# Altium project k7masterProject.PrjPcb
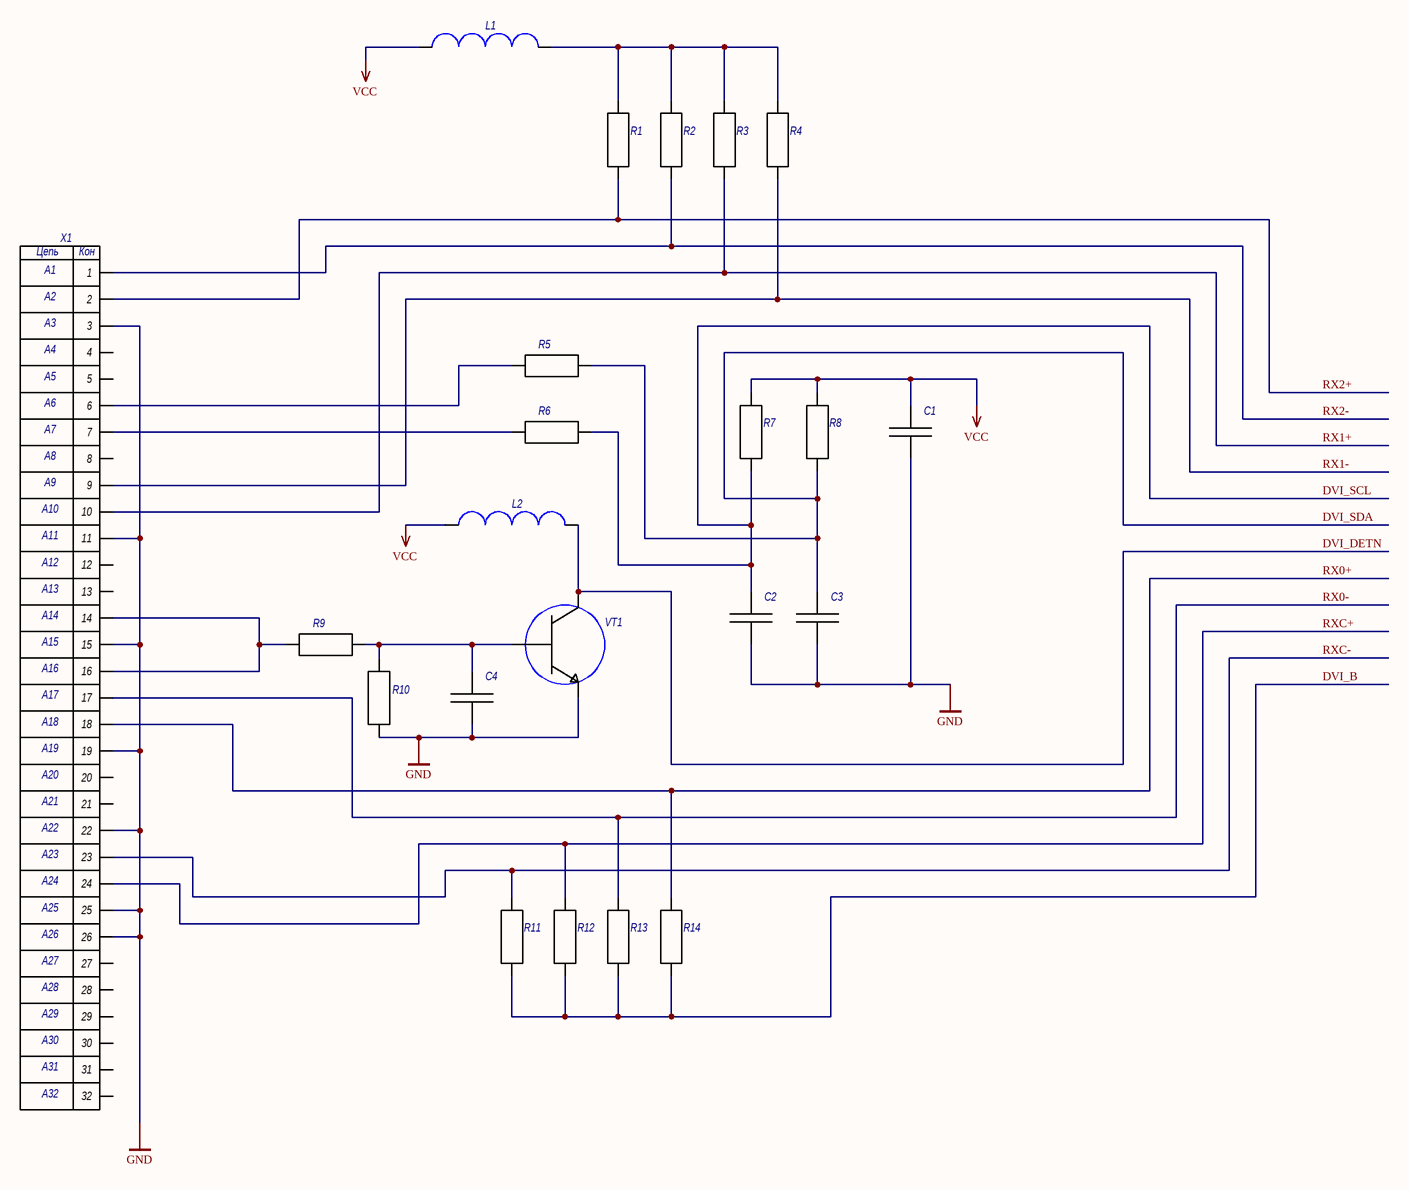
[diagram p0: sch1.SchDoc]
6 sheets, 398 parts. Net scope: global (net labels, ports and power ports of the same name join across sheets).
Board file: PCB2.PcbDoc
Sheets:
  sch1.SchDoc
  sch2.SchDoc
  sch3.SchDoc
  sch4.SchDoc
  sch5_1.SchDoc
  sch6.SchDoc

## Sheet sch1.SchDoc
size 420 x 297 mm; Address1: Address1; Address2: Address2; Address3: Address3; Address4: Address4; DocumentNumber: АБВГ.123456.001 Э3; SheetNumber: 1; Scale: 1:1; DocumentType: Схема электрическая принципиальная; FirstReferrence: АБВГ.123456.001

### Parts
C1  *  [Capacitor 0805]  (value not drawn)
C2  *  [Capacitor 0805]  (value not drawn)
C3  *  [Capacitor 0805]  (value not drawn)
C4  *  [Capacitor 0805]  (value not drawn)
L1  *  [Inductor 2520]  (value not drawn)
L2  *  [Inductor 2520]  (value not drawn)
R1  *  [Resistor 1206]  (value not drawn)
R2  *  [Resistor 1206]  (value not drawn)
R3  *  [Resistor 1206]  (value not drawn)
R4  *  [Resistor 1206]  (value not drawn)
R5  *  [Resistor 1206]  (value not drawn)
R6  *  [Resistor 1206]  (value not drawn)
R7  *  [Resistor 1206]  (value not drawn)
R8  *  [Resistor 1206]  (value not drawn)
R9  *  [Resistor 1206]  (value not drawn)
R10  *  [Resistor 1206]  (value not drawn)
R11  *  [Resistor 1206]  (value not drawn)
R12  *  [Resistor 1206]  (value not drawn)
R13  *  [Resistor 1206]  (value not drawn)
R14  *  [Resistor 1206]  (value not drawn)
VT1  *  [Transistor 1]  (value not drawn)
X1  *  [DVI Connector]  (value not drawn)

### Nets
GND: C1.1 C2.1 C3.1 C4.1 R10.1 VT1.1(KOLLECTOR) X1.3 X1.11 X1.15 X1.19 X1.22 X1.25 X1.26
VCC: C1.2 L1.1 L2.1 R7.2 R8.2
DVI_B: R11.1 R12.1 R13.1 R14.1
DVI_DETN: L2.2 VT1.2(EMITTER)
DVI_SCL: C2.2 R6.2 R7.1
DVI_SDA: C3.2 R5.2 R8.1
RX0+: R14.2 X1.18
RX0-: R13.2 X1.17
RX1+: R3.1 X1.10
RX1-: R4.1 X1.9
RX2+: R1.1 X1.2
RX2-: R2.1 X1.1
RXC+: R12.2 X1.24
RXC-: R11.2 X1.23
NetC4_2: C4.2 R9.2 R10.2 VT1.3(BAZA)
NetL1_2: L1.2 R1.2 R2.2 R3.2 R4.2
NetR5_1: R5.1 X1.6
NetR6_1: R6.1 X1.7
NetR9_1: R9.1 X1.14 X1.16

Not connected (* = marked no-connect by the designer): X1 4 5 8 12 13 20 21 27 28 29 30 31 32

### Notes on the sheet
- Перв. примен.
- Справ. №
- Подп. и дата
- Инв. № дубл.
- Взам. инв. №
- Разраб.
- Изм.
- Лист
- № докум.
- Подп.
- Дата
- Лит.
- Масса
- Масштаб
- Пров.
- Т.контр.
- Листов
- Инв. № подл.
- Утв.
- Н.контр.
- 2.106-A3
- Копировал
- Формат А3
- (in symbol DVI Connector) Цепь; Кон; A1; A2; A3; A4; A5; A6; A7; A8; A9; A10; A11; A12; A13; A14; A15; A16; A17; A18; A19; A20; A21; A22; A23; A24; A25; A26; A27; A28; A29; A30; A31; A32

### Library data of the parts
C1-C4 = Capacitor: Model: *
L1 L2 = Inductor: Model: *
R1-R14 = Resistor: Model: *
VT1 = Transistor 1
X1 = DVI Connector

## Sheet sch2.SchDoc
size 420 x 297 mm; Address1: Address1; Address2: Address2; Address3: Address3; Address4: Address4; DocumentNumber: АБВГ.123456.001 Э3; SheetNumber: 1; Scale: 1:1; DocumentType: Схема электрическая принципиальная; FirstReferrence: АБВГ.123456.001
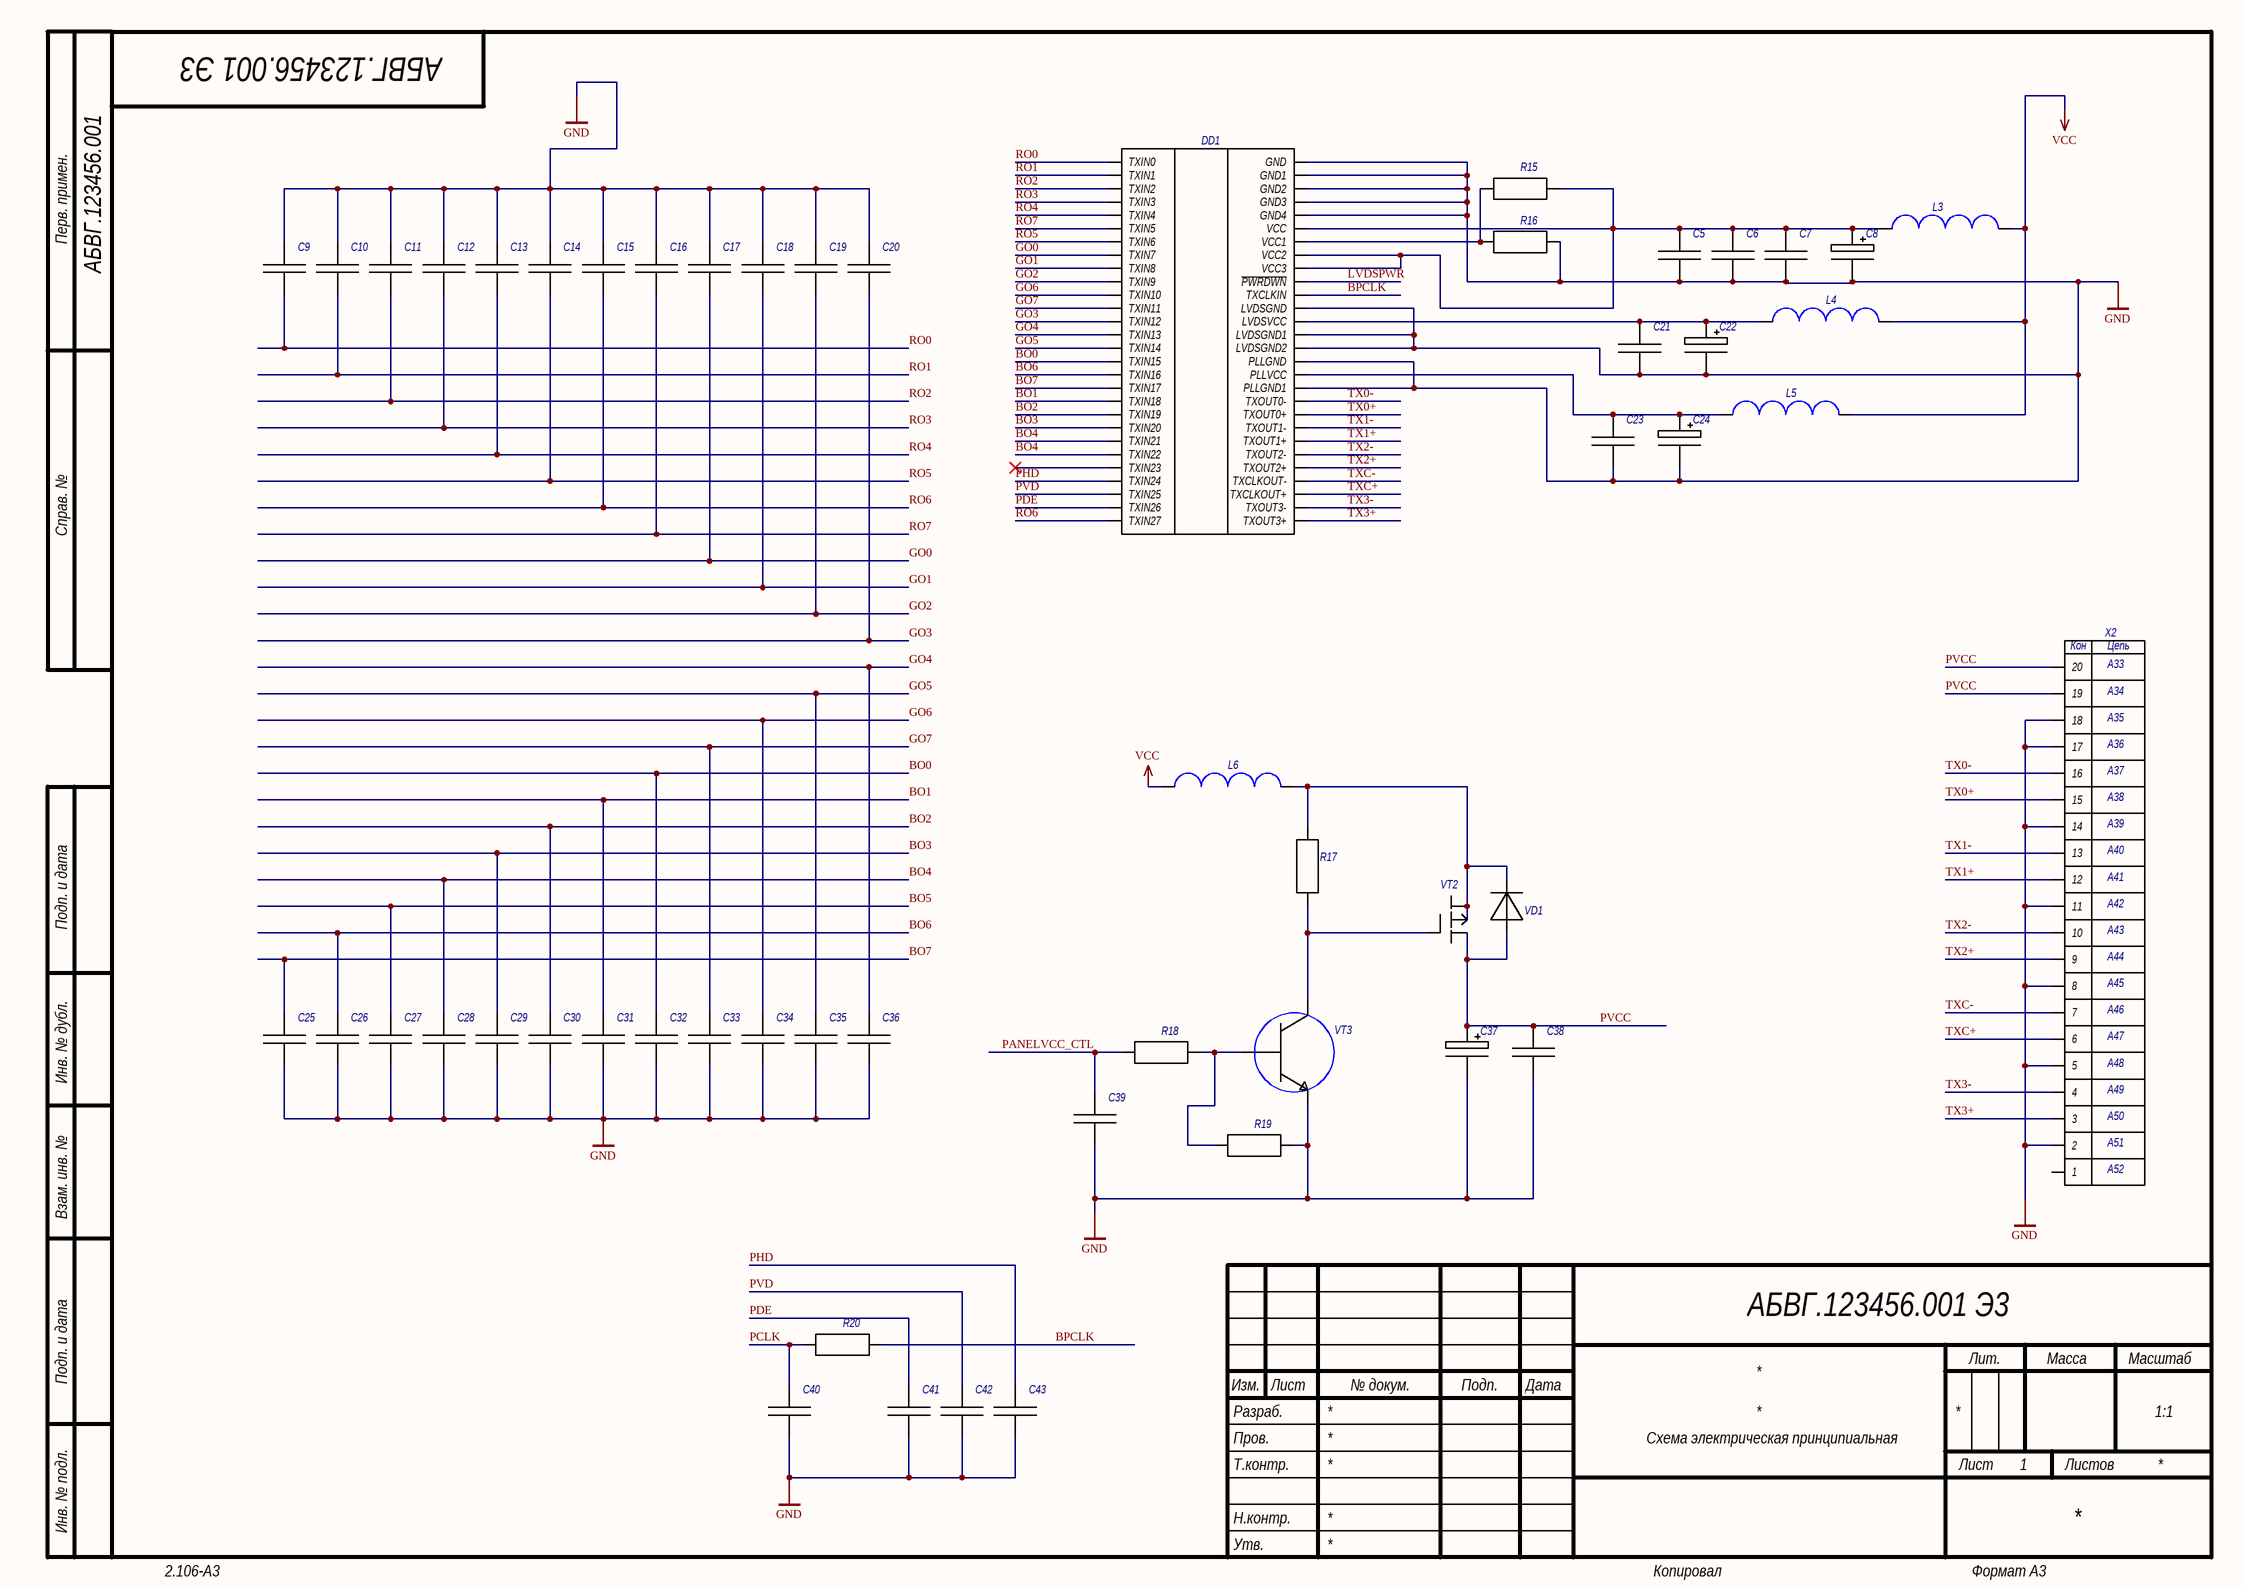
[diagram p1: sch2.SchDoc]

### Parts
C5  *  [Capacitor 0805]  (value not drawn)
C6  *  [Capacitor 0805]  (value not drawn)
C7  *  [Capacitor 0805]  (value not drawn)
C8  *  [Capacitor 0805]  (value not drawn)
C9  *  [Capacitor 0805]  (value not drawn)
C10  *  [Capacitor 0805]  (value not drawn)
C11  *  [Capacitor 0805]  (value not drawn)
C12  *  [Capacitor 0805]  (value not drawn)
C13  *  [Capacitor 0805]  (value not drawn)
C14  *  [Capacitor 0805]  (value not drawn)
C15  *  [Capacitor 0805]  (value not drawn)
C16  *  [Capacitor 0805]  (value not drawn)
C17  *  [Capacitor 0805]  (value not drawn)
C18  *  [Capacitor 0805]  (value not drawn)
C19  *  [Capacitor 0805]  (value not drawn)
C20  *  [Capacitor 0805]  (value not drawn)
C21  *  [Capacitor 0805]  (value not drawn)
C22  *  [Capacitor 0805]  (value not drawn)
C23  *  [Capacitor 0805]  (value not drawn)
C24  *  [Capacitor 0805]  (value not drawn)
C25  *  [Capacitor 0805]  (value not drawn)
C26  *  [Capacitor 0805]  (value not drawn)
C27  *  [Capacitor 0805]  (value not drawn)
C28  *  [Capacitor 0805]  (value not drawn)
C29  *  [Capacitor 0805]  (value not drawn)
C30  *  [Capacitor 0805]  (value not drawn)
C31  *  [Capacitor 0805]  (value not drawn)
C32  *  [Capacitor 0805]  (value not drawn)
C33  *  [Capacitor 0805]  (value not drawn)
C34  *  [Capacitor 0805]  (value not drawn)
C35  *  [Capacitor 0805]  (value not drawn)
C36  *  [Capacitor 0805]  (value not drawn)
C37  *  [Capacitor 0805]  (value not drawn)
C38  *  [Capacitor 0805]  (value not drawn)
C39  *  [Capacitor 0805]  (value not drawn)
C40  *  [Capacitor 0805]  (value not drawn)
C41  *  [Capacitor 0805]  (value not drawn)
C42  *  [Capacitor 0805]  (value not drawn)
C43  *  [Capacitor 0805]  (value not drawn)
DD1  *  [THC63_1]  (value not drawn)
L3  *  [Inductor 2520]  (value not drawn)
L4  *  [Inductor 2520]  (value not drawn)
L5  *  [Inductor 2520]  (value not drawn)
L6  *  [Inductor 2520]  (value not drawn)
R15  *  [Resistor 1206]  (value not drawn)
R16  *  [Resistor 1206]  (value not drawn)
R17  *  [Resistor 1206]  (value not drawn)
R18  *  [Resistor 1206]  (value not drawn)
R19  *  [Resistor 1206]  (value not drawn)
R20  *  [Resistor 1206]  (value not drawn)
VD1  Diode 1  [Diode]  (value not drawn)
VT2  MOP TRANSISTOR  [TR]  (value not drawn)
VT3  *  [Transistor 1]  (value not drawn)
X2  *  [DF14A]  (value not drawn)

### Nets
GND: C5.1 C6.1 C7.1 C8.1 C9.2 C10.2 C11.2 C12.2 C13.2 C14.2 C15.2 C16.2 C17.2 C18.2 C19.2 C20.2 C21.1 C22.1 C23.1 C24.1 C25.1 C26.1 C27.1 C28.1 C29.1 C30.1 C31.1 C32.1 C33.1 C34.1 C35.1 C36.1 C37.1 C38.1 C39.1 C40.1 C41.1 C42.1 C43.1 DD1.39(PLLGND1) DD1.41(PLLGND) DD1.42(LVDSGND2) DD1.43(LVDSGND1) DD1.45(LVDSGND) DD1.52(GND4) DD1.53(GND3) DD1.54(GND2) DD1.55(GND1) DD1.56(GND) R16.2 R19.2 VT3.1(KOLLECTOR) X2.2 X2.5 X2.8 X2.11 X2.14 X2.17 X2.18
VCC: L3.2 L4.2 L5.2 L6.1
BO0: C32.2 DD1.16(TXIN15)
BO1: C31.2 DD1.19(TXIN18)
BO2: C30.2 DD1.20(TXIN19)
BO3: C29.2 DD1.21(TXIN20)
BO4: C28.2 DD1.22(TXIN21) DD1.23(TXIN22)
BO5: C27.2
BO6: C26.2 DD1.17(TXIN16)
BO7: C25.2 DD1.18(TXIN17)
BPCLK: DD1.46(TXCLKIN) R20.2
GO0: C17.1 DD1.8(TXIN7)
GO1: C18.1 DD1.9(TXIN8)
GO2: C19.1 DD1.10(TXIN9)
GO3: C20.1 DD1.13(TXIN12)
GO4: C36.2 DD1.14(TXIN13)
GO5: C35.2 DD1.15(TXIN14)
GO6: C34.2 DD1.11(TXIN10)
GO7: C33.2 DD1.12(TXIN11)
LVDSPWR: DD1.47(~{PWRDWN})
PANELVCC_CTL: C39.2 R18.1
PCLK: C40.2 R20.1
PDE: C41.2 DD1.27(TXIN26)
PHD: C43.2 DD1.25(TXIN24)
PVCC: C37.2 C38.2 VD1.1 VT2.2 X2.19 X2.20
PVD: C42.2 DD1.26(TXIN25)
RO0: C9.1 DD1.1(TXIN0)
RO1: C10.1 DD1.2(TXIN1)
RO2: C11.1 DD1.3(TXIN2)
RO3: C12.1 DD1.4(TXIN3)
RO4: C13.1 DD1.5(TXIN4)
RO5: C14.1 DD1.7(TXIN6)
RO6: C15.1 DD1.28(TXIN27)
RO7: C16.1 DD1.6(TXIN5)
TX0+: DD1.37(TXOUT0+) X2.15
TX0-: DD1.38(TXOUT0-) X2.16
TX1+: DD1.35(TXOUT1+) X2.12
TX1-: DD1.36(TXOUT1-) X2.13
TX2+: DD1.33(TXOUT2+) X2.9
TX2-: DD1.34(TXOUT2-) X2.10
TX3+: DD1.29(TXOUT3+) X2.3
TX3-: DD1.30(TXOUT3-) X2.4
TXC+: DD1.31(TXCLKOUT+) X2.6
TXC-: DD1.32(TXCLKOUT-) X2.7
NetC5_2: C5.2 C6.2 C7.2 C8.2 DD1.48(VCC3) DD1.49(VCC2) DD1.51(VCC) L3.1 R15.2
NetC21_2: C21.2 C22.2 DD1.44(LVDSVCC) L4.1
NetC23_2: C23.2 C24.2 DD1.40(PLLVCC) L5.1
NetDD1_50: DD1.50(VCC1) R15.1 R16.1
NetL6_2: L6.2 R17.2 VD1.2 VT2.3 VT2.4
NetR17_1: R17.1 VT2.1 VT3.2(EMITTER)
NetR18_2: R18.2 R19.1 VT3.3(BAZA)

Not connected (* = marked no-connect by the designer): DD1 24(TXIN23)*; X2 1

### Notes on the sheet
- Перв. примен.
- Справ. №
- Подп. и дата
- Инв. № дубл.
- Взам. инв. №
- Разраб.
- Изм.
- Лист
- № докум.
- Подп.
- Дата
- Лит.
- Масса
- Масштаб
- Пров.
- Т.контр.
- Листов
- Инв. № подл.
- Утв.
- Н.контр.
- 2.106-A3
- Копировал
- Формат А3
- (in symbol DF14A) Кон; Цепь; A33; A34; A35; A36; A37; A38; A39; A40; A41; A42; A43; A44; A45; A46; A47; A48; A49; A50; A51; A52

### Library data of the parts
C5-C7 C9-C21 C23 C25-C36 C38-C43 = Capacitor: Model: *
C8 C22 C24 C37 = Capacitor Duga: Model: *
DD1 = THC63
L3-L6 = Inductor: Model: *
R15-R20 = Resistor: Model: *
VT3 = Transistor 1
X2 = DF14A
VD1 = Diode 1: Model: *

## Sheet sch3.SchDoc
size 420 x 297 mm; Address1: Address1; Address2: Address2; Address3: Address3; Address4: Address4; DocumentNumber: АБВГ.123456.001 Э3; SheetNumber: 1; Scale: 1:1; DocumentType: Схема электрическая принципиальная; FirstReferrence: АБВГ.123456.001
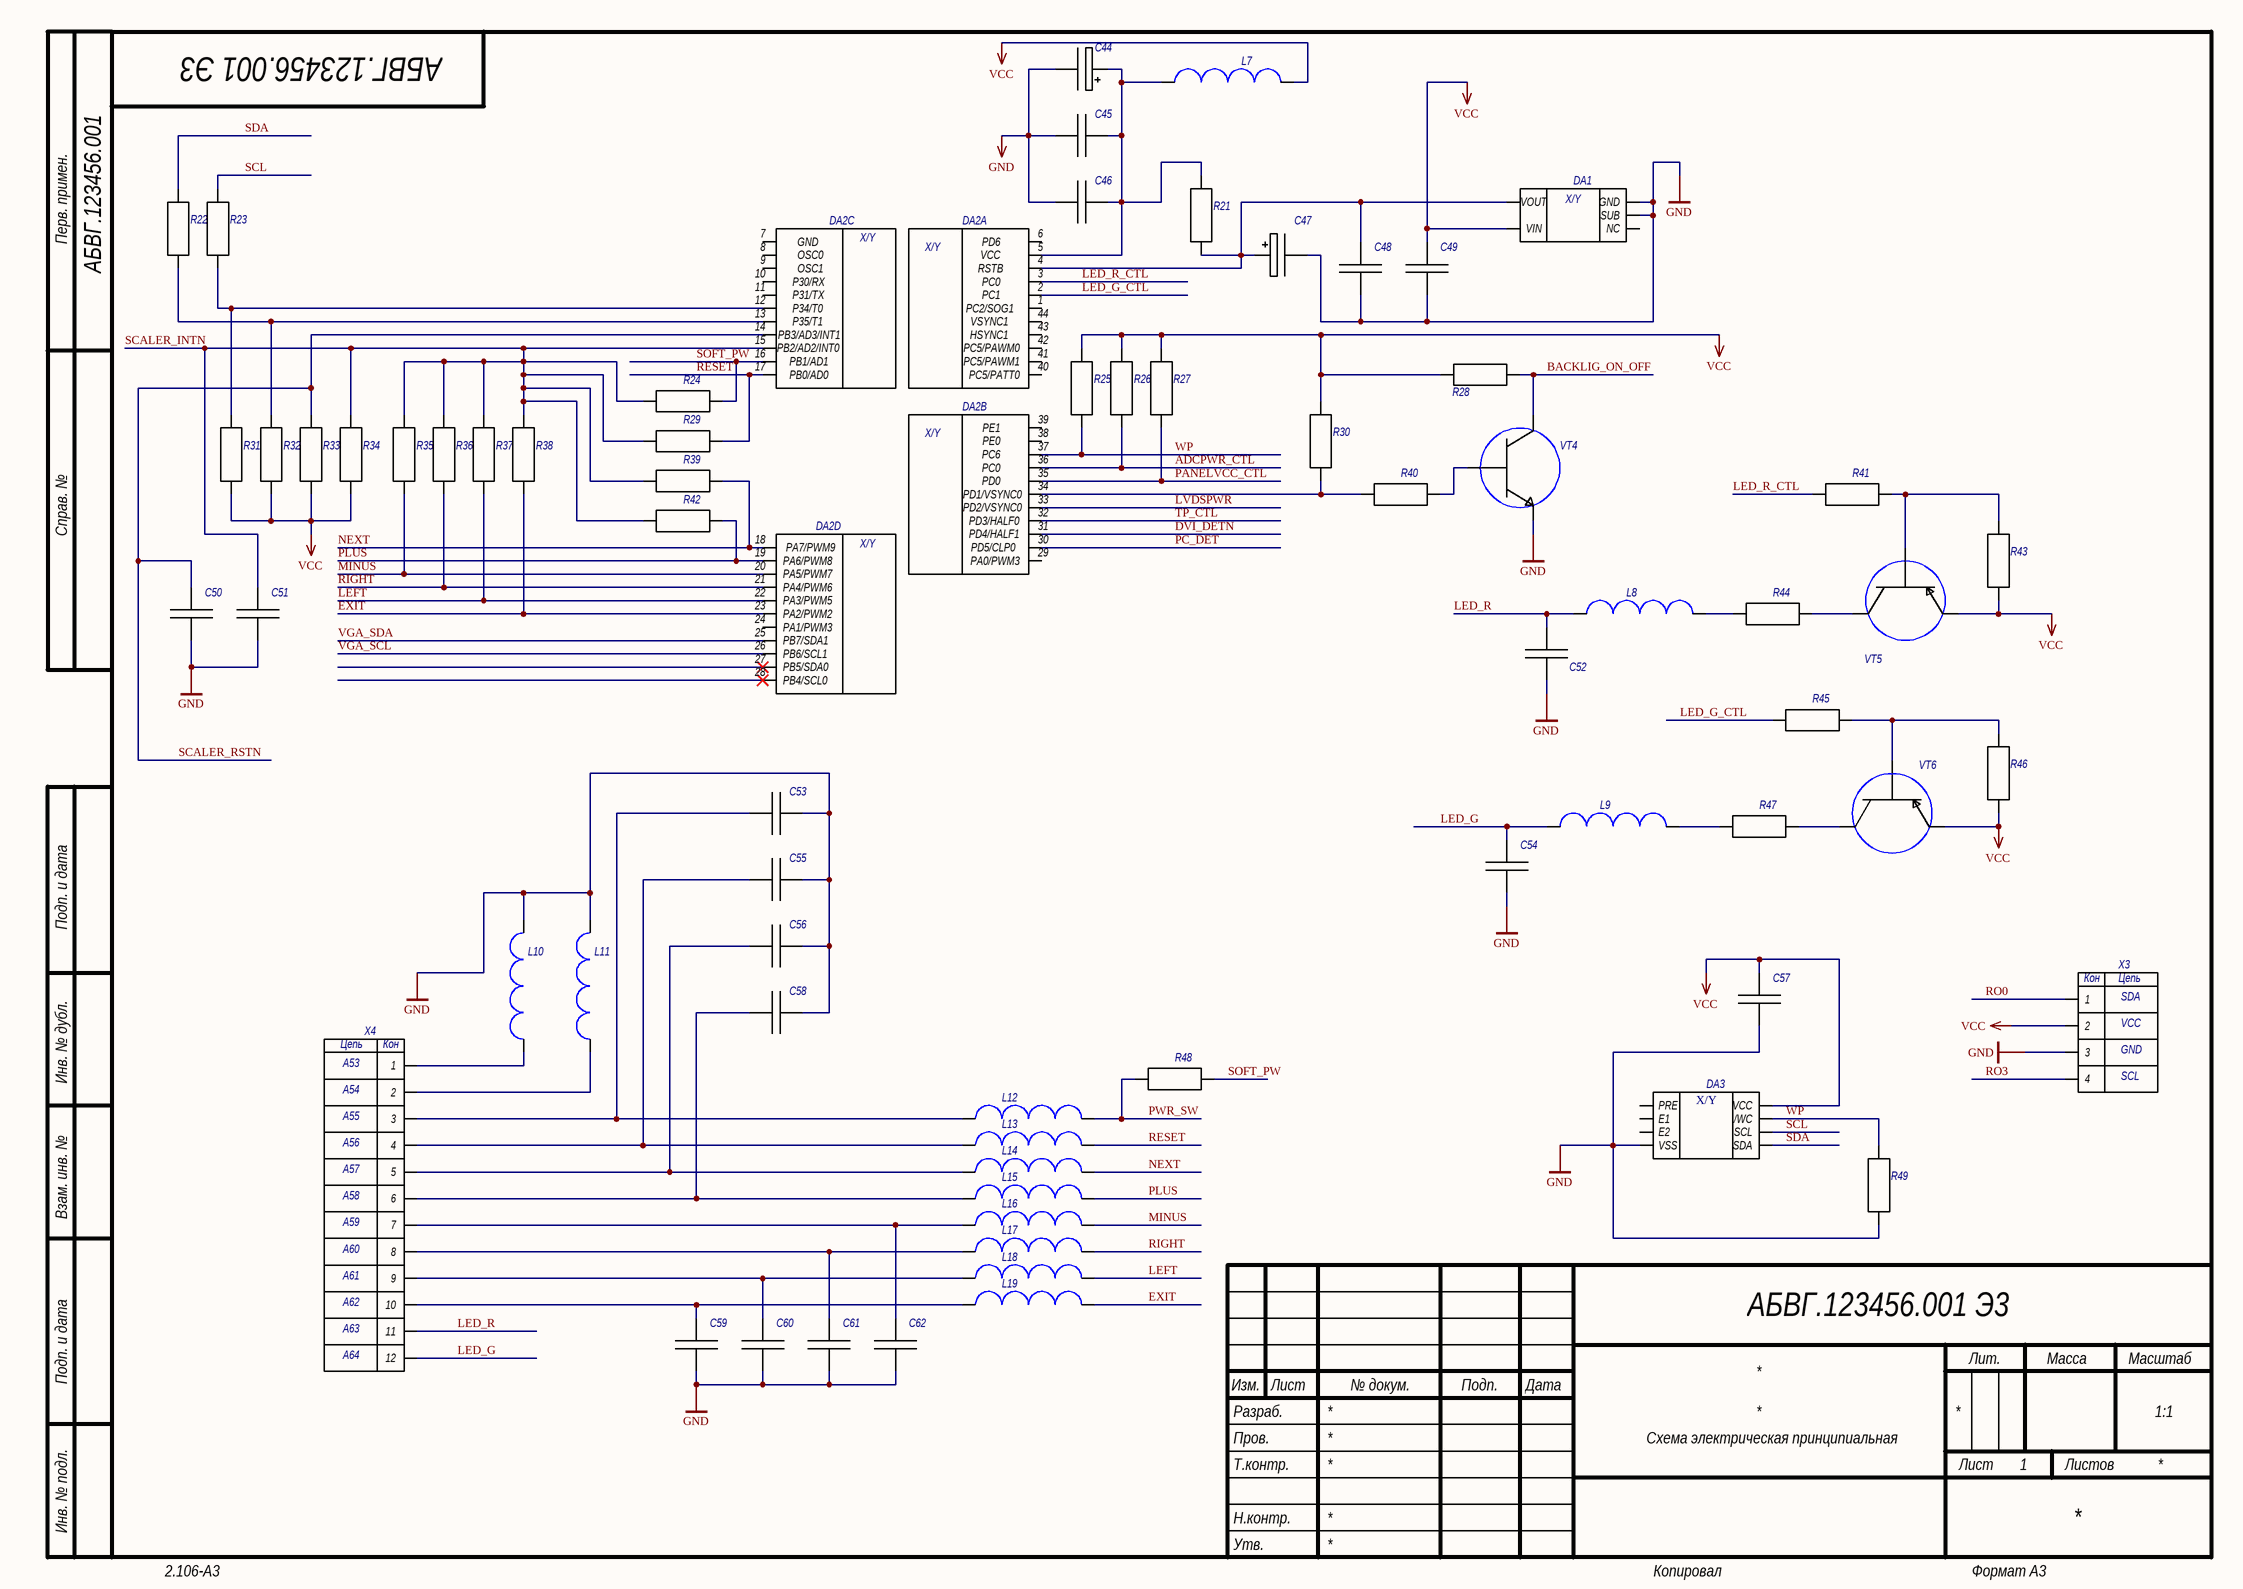
[diagram p2: sch3.SchDoc]

### Parts
C44  *  [Capacitor 0805]  (value not drawn)
C45  *  [Capacitor 0805]  (value not drawn)
C46  *  [Capacitor 0805]  (value not drawn)
C47  *  [Capacitor 0805]  (value not drawn)
C48  *  [Capacitor 0805]  (value not drawn)
C49  *  [Capacitor 0805]  (value not drawn)
C50  *  [Capacitor 0805]  (value not drawn)
C51  *  [Capacitor 0805]  (value not drawn)
C52  *  [Capacitor 0805]  (value not drawn)
C53  *  [Capacitor 0805]  (value not drawn)
C54  *  [Capacitor 0805]  (value not drawn)
C55  *  [Capacitor 0805]  (value not drawn)
C56  *  [Capacitor 0805]  (value not drawn)
C57  *  [Capacitor 0805]  (value not drawn)
C58  *  [Capacitor 0805]  (value not drawn)
C59  *  [Capacitor 0805]  (value not drawn)
C60  *  [Capacitor 0805]  (value not drawn)
C61  *  [Capacitor 0805]  (value not drawn)
C62  *  [Capacitor 0805]  (value not drawn)
DA1  IC103  [IC103_2]  (value not drawn)
DA2  *  [NT68]  (value not drawn)  (parts A,B,C,D of 4)
DA3  *  [IC102]  (value not drawn)
L7  *  [Inductor 2520]  (value not drawn)
L8  *  [Inductor 2520]  (value not drawn)
L9  *  [Inductor 2520]  (value not drawn)
L10  *  [Inductor 2520]  (value not drawn)
L11  *  [Inductor 2520]  (value not drawn)
L12  *  [Inductor 2520]  (value not drawn)
L13  *  [Inductor 2520]  (value not drawn)
L14  *  [Inductor 2520]  (value not drawn)
L15  *  [Inductor 2520]  (value not drawn)
L16  *  [Inductor 2520]  (value not drawn)
L17  *  [Inductor 2520]  (value not drawn)
L18  *  [Inductor 2520]  (value not drawn)
L19  *  [Inductor 2520]  (value not drawn)
R21  *  [Resistor 1206]  (value not drawn)
R22  *  [Resistor 1206]  (value not drawn)
R23  *  [Resistor 1206]  (value not drawn)
R24  *  [Resistor 1206]  (value not drawn)
R25  *  [Resistor 1206]  (value not drawn)
R26  *  [Resistor 1206]  (value not drawn)
R27  *  [Resistor 1206]  (value not drawn)
R28  *  [Resistor 1206]  (value not drawn)
R29  *  [Resistor 1206]  (value not drawn)
R30  *  [Resistor 1206]  (value not drawn)
R31  *  [Resistor 1206]  (value not drawn)
R32  *  [Resistor 1206]  (value not drawn)
R33  *  [Resistor 1206]  (value not drawn)
R34  *  [Resistor 1206]  (value not drawn)
R35  *  [Resistor 1206]  (value not drawn)
R36  *  [Resistor 1206]  (value not drawn)
R37  *  [Resistor 1206]  (value not drawn)
R38  *  [Resistor 1206]  (value not drawn)
R39  *  [Resistor 1206]  (value not drawn)
R40  *  [Resistor 1206]  (value not drawn)
R41  *  [Resistor 1206]  (value not drawn)
R42  *  [Resistor 1206]  (value not drawn)
R43  *  [Resistor 1206]  (value not drawn)
R44  *  [Resistor 1206]  (value not drawn)
R45  *  [Resistor 1206]  (value not drawn)
R46  *  [Resistor 1206]  (value not drawn)
R47  *  [Resistor 1206]  (value not drawn)
R48  *  [Resistor 1206]  (value not drawn)
R49  *  [Resistor 1206]  (value not drawn)
VT4  *  [Transistor 1]  (value not drawn)
VT5  *  [Transistor 1]  (value not drawn)
VT6  *  [Transistor 1]  (value not drawn)
X3  *  [BUSES]  (value not drawn)
X4  *  [J101]  (value not drawn)

### Nets
GND: C44.1 C45.2 C46.2 C47.1 C48.2 C49.2 C50.1 C51.1 C52.1 C53.1 C54.1 C55.1 C56.1 C57.1 C58.1 C59.1 C60.1 C61.1 C62.1 DA1.1(GND) DA1.2(SUB) DA3.4(VSS) L10.2 L11.2 R49.1 VT4.1(KOLLECTOR) X3.3
VCC: C49.1 C57.2 DA1.5(VIN) DA3.5(VCC) L7.2 R25.2 R26.2 R27.2 R28.1 R30.2 R31.1 R32.1 R33.1 R34.1 R43.1 R46.1 VT5.2(EMITTER) VT6.2(EMITTER) X3.2
ADCPWR_CTL: DA2.36(PC0) R26.1
BACKLIG_ON_OFF: R28.2 VT4.2(EMITTER)
DVI_DETN: DA2.31(PD4/HALF1)
EXIT: DA2.23(PA2/PWM2) L19.2 R38.1
LED_G: C54.2 L9.1 X4.12
LED_G_CTL: DA2.2(PC1) R45.1
LED_R: C52.2 L8.1 X4.11
LED_R_CTL: DA2.3(PC0) R41.1
LEFT: DA2.22(PA3/PWM5) L18.2 R37.1
LVDSPWR: DA2.33(PD2/VSYNC0)
MINUS: DA2.20(PA5/PWM7) L16.2 R35.1
NEXT: DA2.18(PA7/PWM9) L14.2 R39.2
PANELVCC_CTL: DA2.35(PD0) R27.1
PC_DET: DA2.30(PD5/CLP0)
PLUS: DA2.19(PA6/PWM8) L15.2 R42.2
PWR_SW: L12.2 R48.1
RESET: DA2.17(PB0/AD0) L13.2 R29.2
RIGHT: DA2.21(PA4/PWM6) L17.2 R36.1
RO0: X3.1
RO3: X3.4
SCALER_INTN: C51.2 DA2.15(PB2/AD2/INT0) R24.1 R29.1 R34.2 R35.2 R36.2 R37.2 R38.2 R39.1 R42.1
SCALER_RSTN: C50.2 DA2.14(PB3/AD3/INT1) R33.2
SCL: DA3.7(SCL) R23.2
SDA: DA3.8(SDA) R22.2
SOFT_PW: DA2.16(PB1/AD1) R24.2 R48.2
TP_CTL: DA2.32(PD3/HALF0)
VGA_SCL: DA2.26(PB6/SCL1)
VGA_SDA: DA2.25(PB7/SDA1)
WP: DA2.37(PC6) DA3.6(/WC) R25.1 R49.2
NetC44_2: C44.2 C45.1 C46.1 DA2.5(VCC) L7.1 R21.2
NetC47_2: C47.2 C48.1 DA1.4(VOUT) DA2.4(RSTB) R21.1
NetC53_2: C53.2 L12.1 X4.3
NetC55_2: C55.2 L13.1 X4.4
NetC56_2: C56.2 L14.1 X4.5
NetC58_2: C58.2 L15.1 X4.6
NetC59_2: C59.2 L19.1 X4.10
NetC60_2: C60.2 L18.1 X4.9
NetC61_2: C61.2 L17.1 X4.8
NetC62_2: C62.2 L16.1 X4.7
NetDA2_12: DA2.12(P34/T0) R23.1 R31.2
NetDA2_13: DA2.13(P35/T1) R22.1 R32.2
NetDA2_34: DA2.34(PD1/VSYNC0) R30.1 R40.1
NetL8_2: L8.2 R44.1
NetL9_2: L9.2 R47.1
NetL10_1: L10.1 X4.1
NetL11_1: L11.1 X4.2
NetR40_2: R40.2 VT4.3(BAZA)
NetR41_2: R41.2 R43.2 VT5.3(BAZA)
NetR44_2: R44.2 VT5.1(KOLLECTOR)
NetR45_2: R45.2 R46.2 VT6.3(BAZA)
NetR47_2: R47.2 VT6.1(KOLLECTOR)

Not connected (* = marked no-connect by the designer): DA1 3(NC); DA2 1(PC2/SOG1) 6(PD6) 7(GND) 8(OSC0) 9(OSC1) 10(P30/RX) 11(P31/TX) 24(PA1/PWM3) 27(PB5/SDA0)* 28(PB4/SCL0)* 29(PA0/PWM3) 38(PE0) 39(PE1) 40(PC5/PATT0) 41(PC5/PAWM1) 42(PC5/PAWM0) 43(HSYNC1) 44(VSYNC1); DA3 1(PRE) 2(E1) 3(E2)

### Notes on the sheet
- Перв. примен.
- Справ. №
- Подп. и дата
- Инв. № дубл.
- Взам. инв. №
- Разраб.
- Изм.
- Лист
- № докум.
- Подп.
- Дата
- Лит.
- Масса
- Масштаб
- Пров.
- Т.контр.
- Листов
- Инв. № подл.
- Утв.
- Н.контр.
- 2.106-A3
- Копировал
- Формат А3
- (in symbol IC102) X/Y
- (in symbol IC103) X/Y
- (in symbol J101) Цепь; Кон; A53; A54; A55; A56; A57; A58; A59; A60; A61; A62; A63; A64
- (in symbol J102) Кон; Цепь; SDA; VCC; GND; SCL
- (in symbol NT68, part A) X/Y
- (in symbol NT68, part B) X/Y
- (in symbol NT68, part C) X/Y
- (in symbol NT68, part D) X/Y

### Library data of the parts
C44 C47 = Capacitor Duga: Model: *
C45 C46 C48-C62 = Capacitor: Model: *
DA2 = NT68
DA3 = IC102
L7-L19 = Inductor: Model: *
R21-R49 = Resistor: Model: *
VT4 = Transistor 1
VT5 VT6 = Transistor 2
X3 = J102
X4 = J101

## Sheet sch4.SchDoc
size 420 x 297 mm; Address1: Address1; Address2: Address2; Address3: Address3; Address4: Address4; DocumentNumber: АБВГ.123456.001 Э3; SheetNumber: 1; Scale: 1:1; DocumentType: Схема электрическая принципиальная; FirstReferrence: АБВГ.123456.001
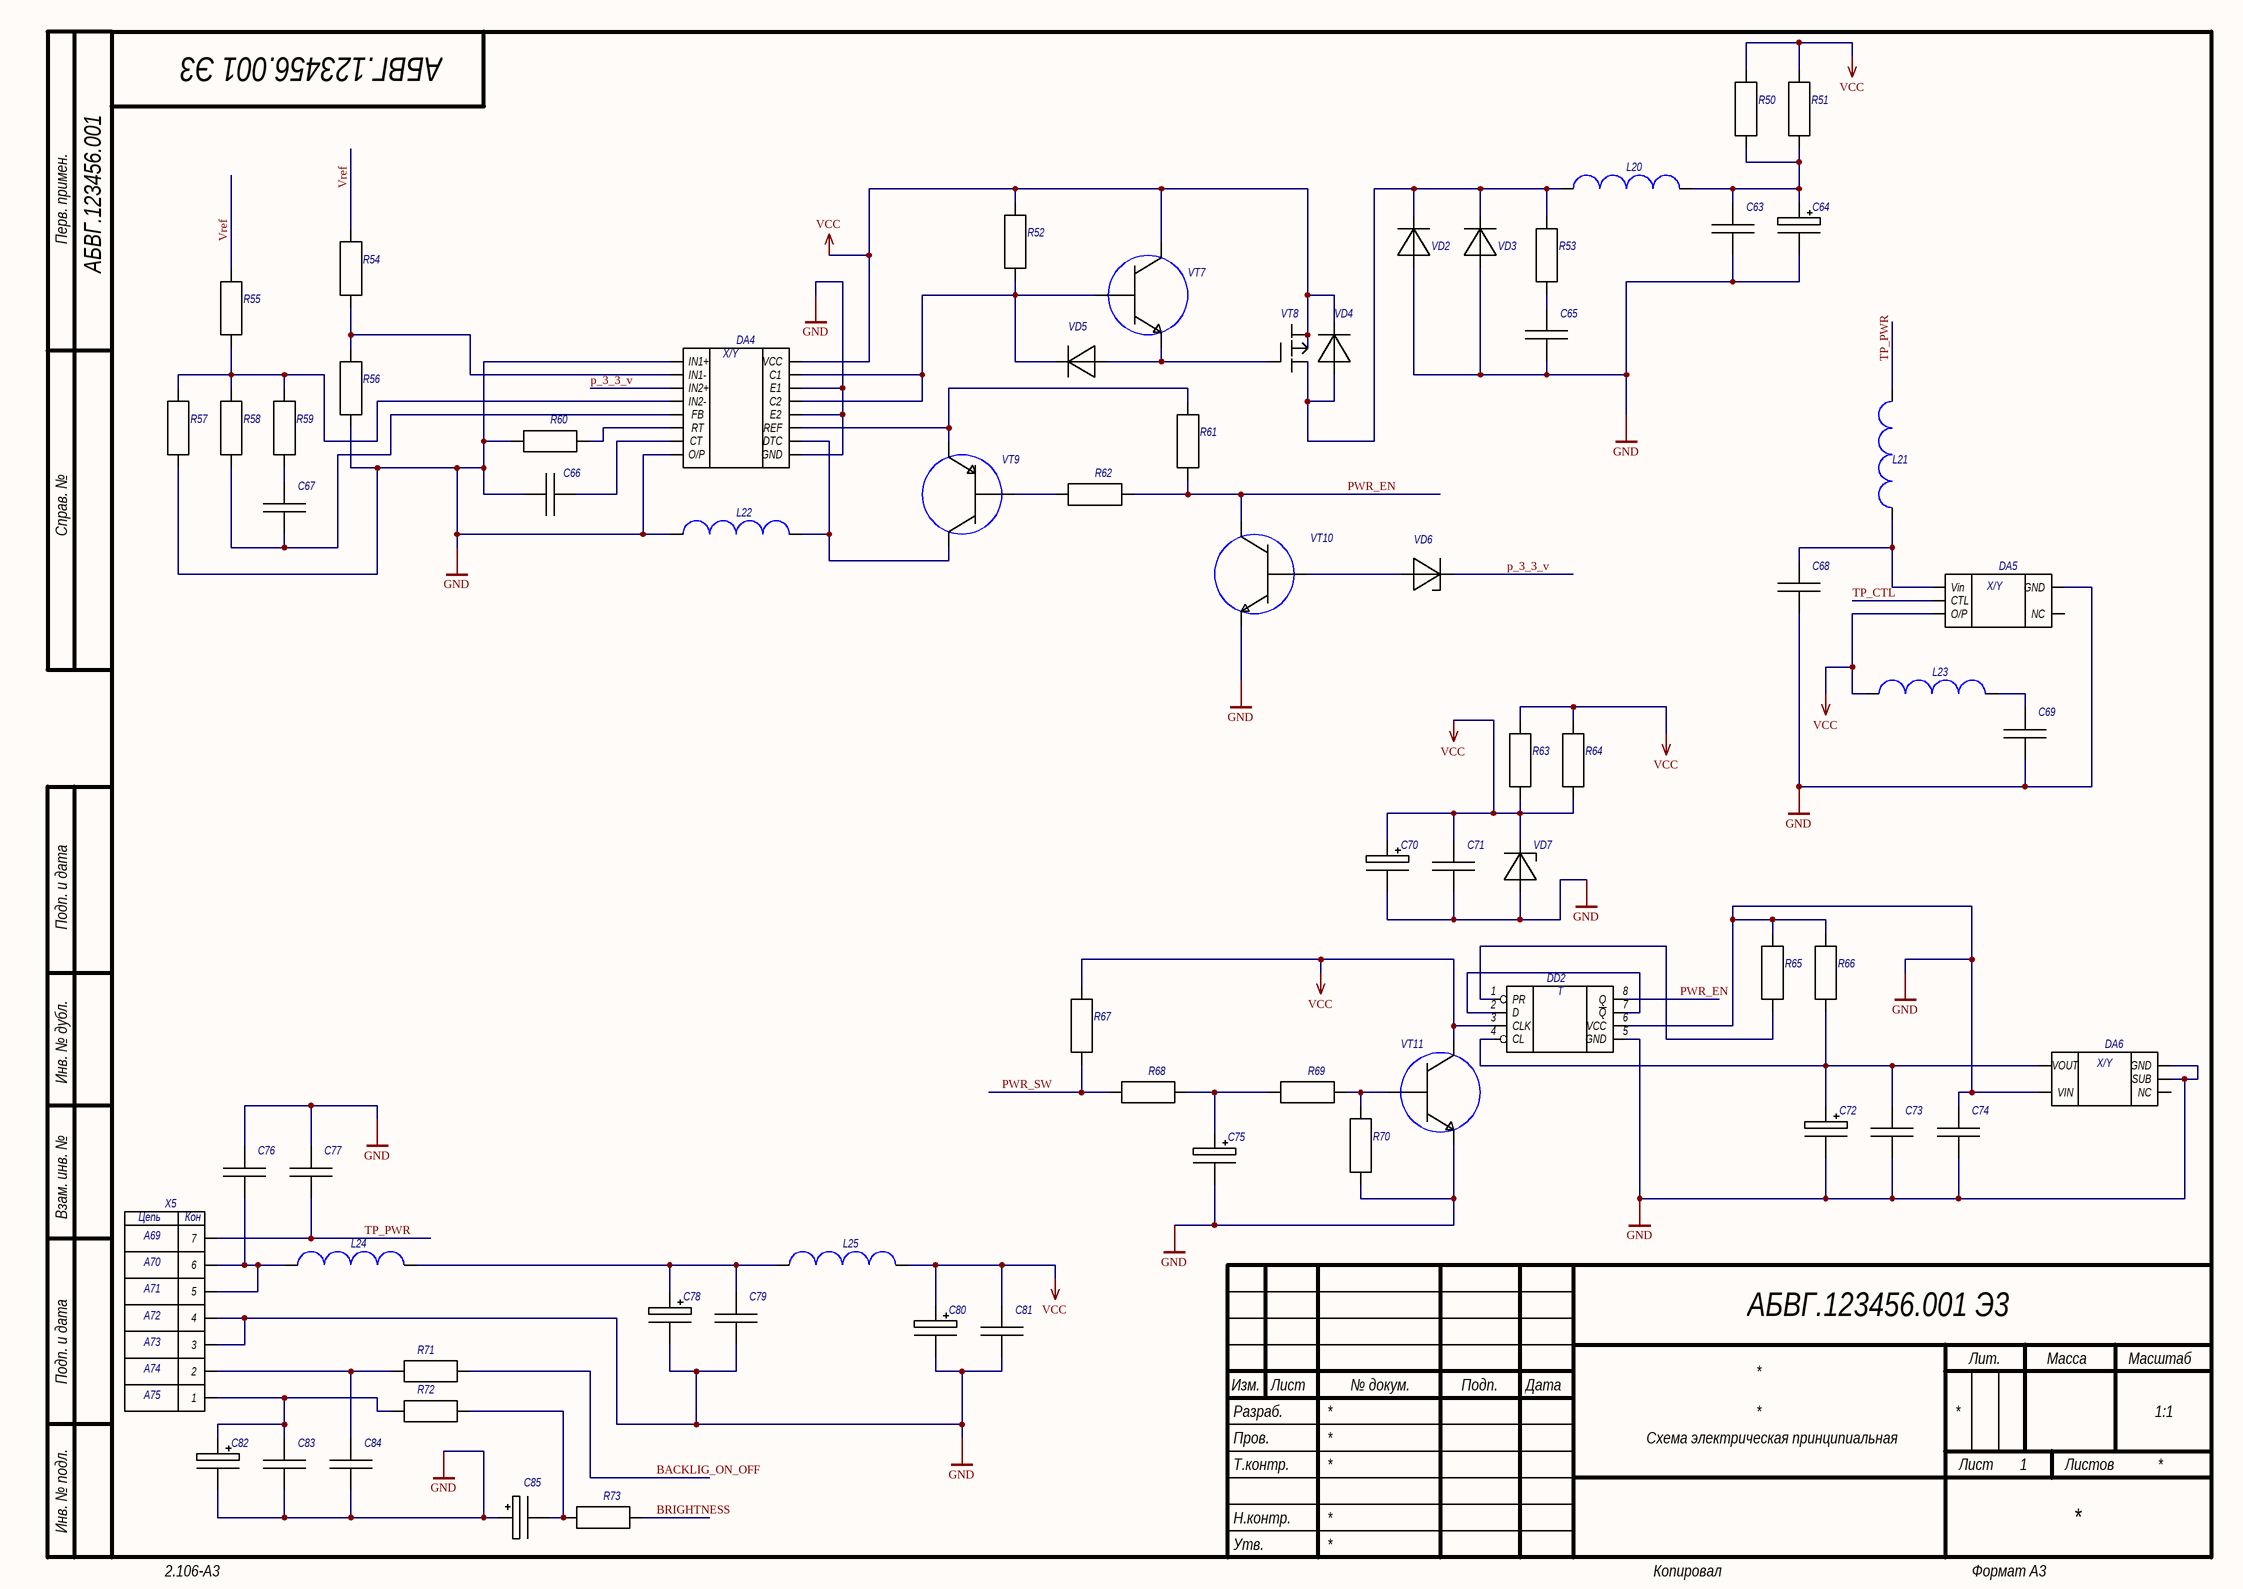
[diagram p3: sch4.SchDoc]

### Parts
C63  *  [Capacitor 0805]  (value not drawn)
C64  *  [Capacitor 0805]  (value not drawn)
C65  *  [Capacitor 0805]  (value not drawn)
C66  *  [Capacitor 0805]  (value not drawn)
C67  *  [Capacitor 0805]  (value not drawn)
C68  *  [Capacitor 0805]  (value not drawn)
C69  *  [Capacitor 0805]  (value not drawn)
C70  *  [Capacitor 0805]  (value not drawn)
C71  *  [Capacitor 0805]  (value not drawn)
C72  *  [Capacitor 0805]  (value not drawn)
C73  *  [Capacitor 0805]  (value not drawn)
C74  *  [Capacitor 0805]  (value not drawn)
C75  *  [Capacitor 0805]  (value not drawn)
C76  *  [Capacitor 0805]  (value not drawn)
C77  *  [Capacitor 0805]  (value not drawn)
C78  *  [Capacitor 0805]  (value not drawn)
C79  *  [Capacitor 0805]  (value not drawn)
C80  *  [Capacitor 0805]  (value not drawn)
C81  *  [Capacitor 0805]  (value not drawn)
C82  *  [Capacitor 0805]  (value not drawn)
C83  *  [Capacitor 0805]  (value not drawn)
C84  *  [Capacitor 0805]  (value not drawn)
C85  *  [Capacitor 0805]  (value not drawn)
DA4  *  [AP494A_1]  (value not drawn)
DA5  *  [PQ05]  (value not drawn)
DA6  IC103  [IC103_2]  (value not drawn)
DD2  *  [D FF]  (value not drawn)
L20  *  [Inductor 2520]  (value not drawn)
L21  *  [Inductor 2520]  (value not drawn)
L22  *  [Inductor 2520]  (value not drawn)
L23  *  [Inductor 2520]  (value not drawn)
L24  *  [Inductor 2520]  (value not drawn)
L25  *  [Inductor 2520]  (value not drawn)
R50  *  [Resistor 1206]  (value not drawn)
R51  *  [Resistor 1206]  (value not drawn)
R52  *  [Resistor 1206]  (value not drawn)
R53  *  [Resistor 1206]  (value not drawn)
R54  *  [Resistor 1206]  (value not drawn)
R55  *  [Resistor 1206]  (value not drawn)
R56  *  [Resistor 1206]  (value not drawn)
R57  *  [Resistor 1206]  (value not drawn)
R58  *  [Resistor 1206]  (value not drawn)
R59  *  [Resistor 1206]  (value not drawn)
R60  *  [Resistor 1206]  (value not drawn)
R61  *  [Resistor 1206]  (value not drawn)
R62  *  [Resistor 1206]  (value not drawn)
R63  *  [Resistor 1206]  (value not drawn)
R64  *  [Resistor 1206]  (value not drawn)
R65  *  [Resistor 1206]  (value not drawn)
R66  *  [Resistor 1206]  (value not drawn)
R67  *  [Resistor 1206]  (value not drawn)
R68  *  [Resistor 1206]  (value not drawn)
R69  *  [Resistor 1206]  (value not drawn)
R70  *  [Resistor 1206]  (value not drawn)
R71  *  [Resistor 1206]  (value not drawn)
R72  *  [Resistor 1206]  (value not drawn)
R73  *  [Resistor 1206]  (value not drawn)
VD2  *  [Diode]  (value not drawn)
VD3  *  [Diode]  (value not drawn)
VD4  Diode 1  [Diode]  (value not drawn)
VD5  *  [Diode]  (value not drawn)
VD6  *  [Diode]  (value not drawn)
VD7  *  [Diode]  (value not drawn)
VT7  *  [Transistor 1]  (value not drawn)
VT8  MOP TRANSISTOR  [TR]  (value not drawn)
VT9  *  [Transistor 1]  (value not drawn)
VT10  *  [Transistor 1]  (value not drawn)
VT11  *  [Transistor 1]  (value not drawn)
X5  *  [J601]  (value not drawn)

### Nets
GND: C63.1 C64.1 C65.1 C66.2 C68.1 C69.1 C70.1 C71.1 C72.1 C73.1 C74.1 C74.2 C75.1 C76.2 C77.2 C78.1 C79.1 C80.1 C81.1 C82.1 C83.1 C84.1 C85.2 DA4.1(IN1+) DA4.8(O/P) DA4.9(GND) DA4.12(E2) DA4.14(E1) DA5.5(GND) DA6.1(GND) DA6.2(SUB) DA6.5(VIN) DD2.5(GND) DD2.6(VCC) L22.1 R56.1 R57.1 R60.1 R65.2 R66.2 R70.1 VD2.1 VD3.1 VD7.1 VT10.2(EMITTER) VT11.1(KOLLECTOR) X5.3 X5.4
VCC: C70.2 C71.2 C80.2 C81.2 DA4.16(VCC) DA5.3(O/P) DD2.3(CLK) L23.1 L25.2 R50.2 R51.2 R52.2 R63.1 R63.2 R64.1 R64.2 R67.2 VD4.2 VD7.2 VT7.2(EMITTER) VT8.3 VT8.4 VT11.2(EMITTER)
BACKLIG_ON_OFF: R71.2
BRIGHTNESS: R73.2
p_3_3_v: DA4.3(IN2+) VD6.2
PWR_EN: DD2.8(Q) R61.1 R62.2 VT10.1(KOLLECTOR)
PWR_SW: R67.1 R68.1
TP_CTL: DA5.2(CTL)
TP_PWR: C77.1 L21.2 X5.7
Vref: R54.2 R55.2
NetC63_2: C63.2 C64.2 L20.2 R50.1 R51.1
NetC65_2: C65.2 R53.1
NetC66_1: C66.1 DA4.7(CT)
NetC67_1: C67.1 DA4.5(FB) R58.1
NetC67_2: C67.2 R59.1
NetC68_2: C68.2 DA5.1(Vin) L21.1
NetC69_2: C69.2 L23.2
NetC72_2: C72.2 C73.2 DA6.4(VOUT) DD2.4(CL) R66.1
NetC75_2: C75.2 R68.2 R69.1
NetC76_1: C76.1 L24.1 X5.5 X5.6
NetC78_2: C78.2 C79.2 L24.2 L25.1
NetC82_2: C82.2 C83.2 R72.1 X5.1
NetC84_2: C84.2 R71.1 X5.2
NetC85_1: C85.1 R72.2 R73.1
NetDA4_2: DA4.2(IN1-) R54.1 R56.2
NetDA4_4: DA4.4(IN2-) R55.1 R57.2 R58.2 R59.2
NetDA4_6: DA4.6(RT) R60.2
NetDA4_10: DA4.10(DTC) L22.2 VT9.2(EMITTER)
NetDA4_11: DA4.11(REF) R61.2 VT9.1(KOLLECTOR)
NetDA4_13: DA4.13(C2) DA4.15(C1) R52.1 VD5.2 VT7.3(BAZA)
NetDD2_1: DD2.1(PR) R65.1
NetDD2_2: DD2.2(D) DD2.7(~{Q})
NetL20_1: L20.1 R53.2 VD2.2 VD3.2 VD4.1 VT8.2
NetR62_1: R62.1 VT9.3(BAZA)
NetR69_2: R69.2 R70.2 VT11.3(BAZA)
NetVD5_1: VD5.1 VT7.1(KOLLECTOR) VT8.1
NetVD6_1: VD6.1 VT10.3(BAZA)

Not connected (* = marked no-connect by the designer): DA5 4(NC); DA6 3(NC)

### Notes on the sheet
- Перв. примен.
- Справ. №
- Подп. и дата
- Инв. № дубл.
- Взам. инв. №
- Разраб.
- Изм.
- Лист
- № докум.
- Подп.
- Дата
- Лит.
- Масса
- Масштаб
- Пров.
- Т.контр.
- Листов
- Инв. № подл.
- Утв.
- Н.контр.
- 2.106-A3
- Копировал
- Формат А3
- (in symbol 74F74) T
- (in symbol AP494A) X/Y
- (in symbol IC103) X/Y
- (in symbol J601) Цепь; Кон; A69; A70; A71; A72; A73; A74; A75
- (in symbol PQ05) X/Y

### Library data of the parts
C63 C65-C69 C71 C73 C74 C76 C77 C79 C81 C83 C84 = Capacitor: Model: *
C64 C70 C72 C75 C78 C80 C82 C85 = Capacitor Duga: Model: *
DA4 = AP494A
DA5 = PQ05
DD2 = 74F74
L20-L25 = Inductor: Model: *
R50-R73 = Resistor: Model: *
VD2 VD3 VD5 = Diode 1: Model: *
VD6 VD7 = Diode 2: Model: *
VT7 VT11 = Transistor 1
VT9 = Transistor 1_1
VT10 = Transistor 2_1
X5 = J601
VD4 = Diode 1: Model: *

## Sheet sch5_1.SchDoc
size 840 x 594 mm; Address1: Address1; Address2: Address2; Address3: Address3; Address4: Address4; DocumentNumber: АБВГ.123456.001 Э3; SheetNumber: 1; Scale: 1:1; DocumentType: Схема электрическая принципиальная; FirstReferrence: АБВГ.123456.001
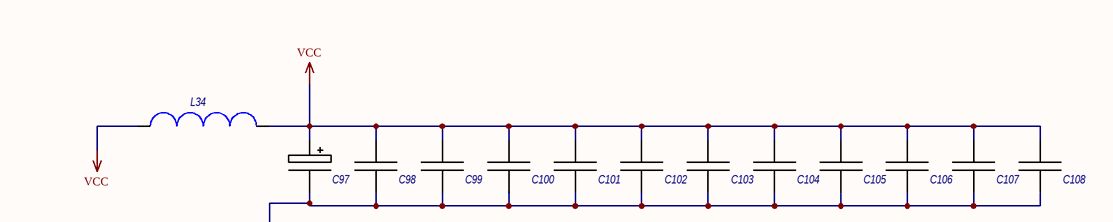
[diagram p4: sch5_1.SchDoc, top left]
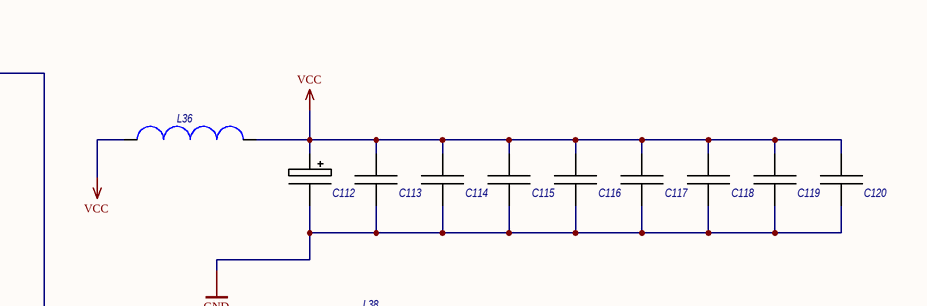
[diagram p5: sch5_1.SchDoc, top right]
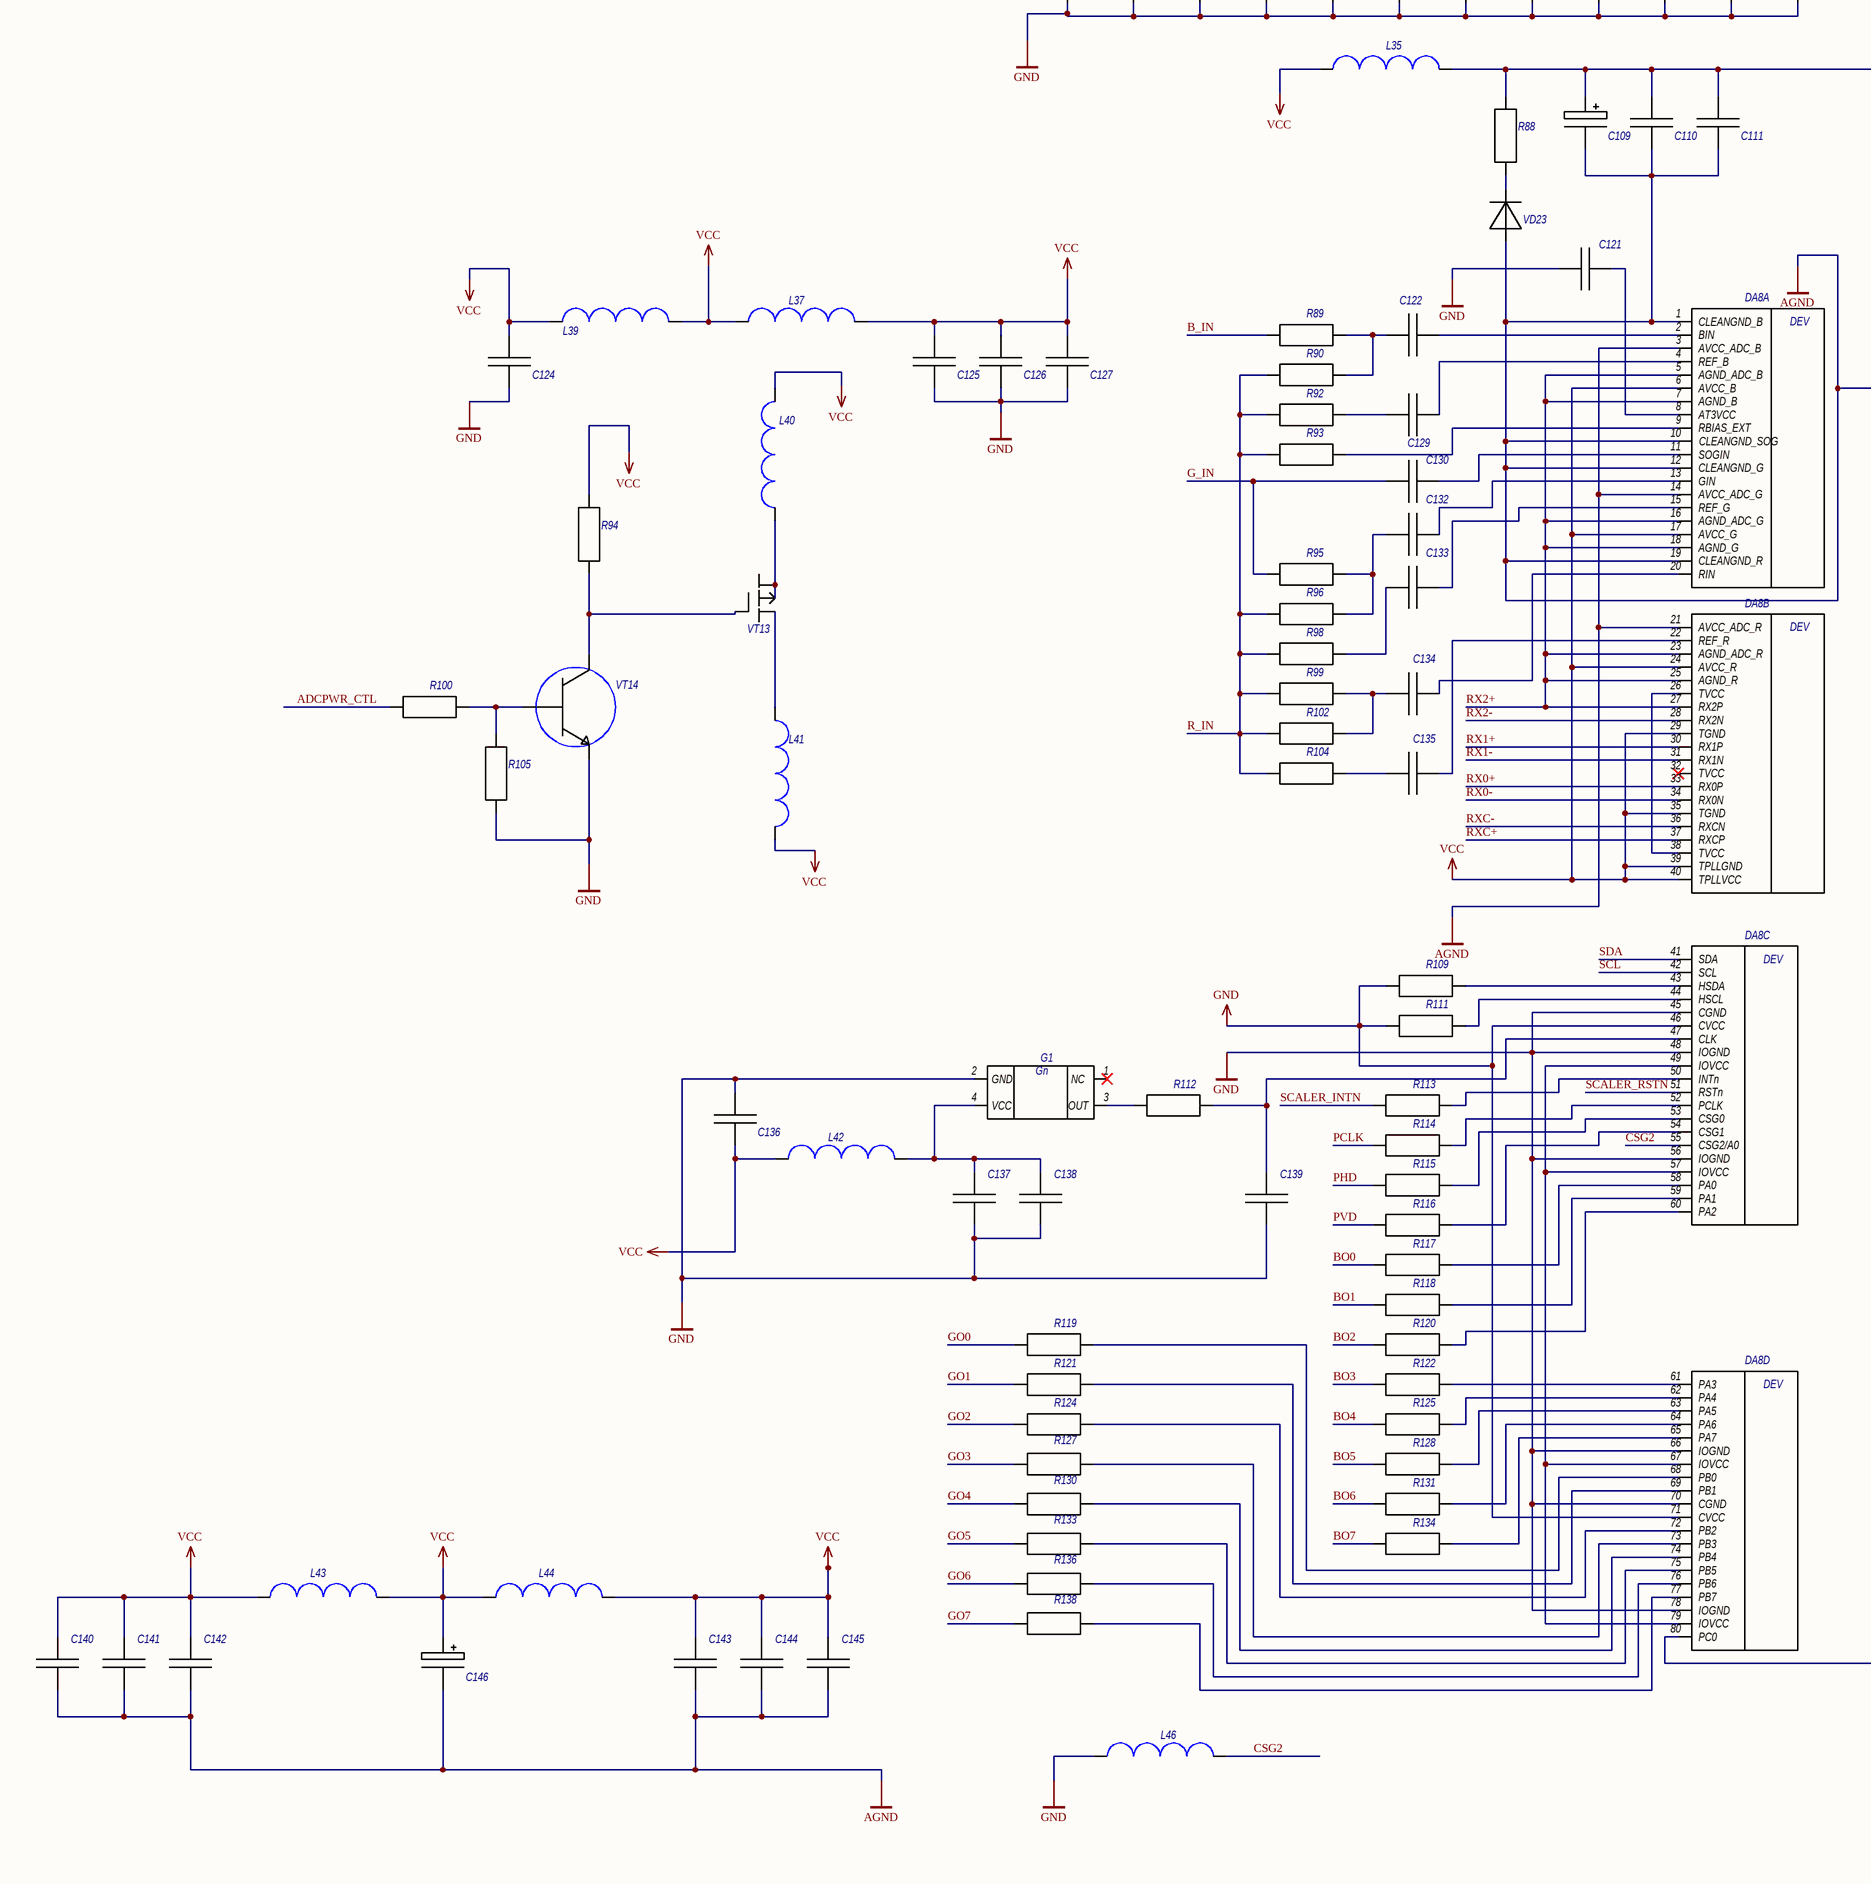
[diagram p6: sch5_1.SchDoc, bottom left]
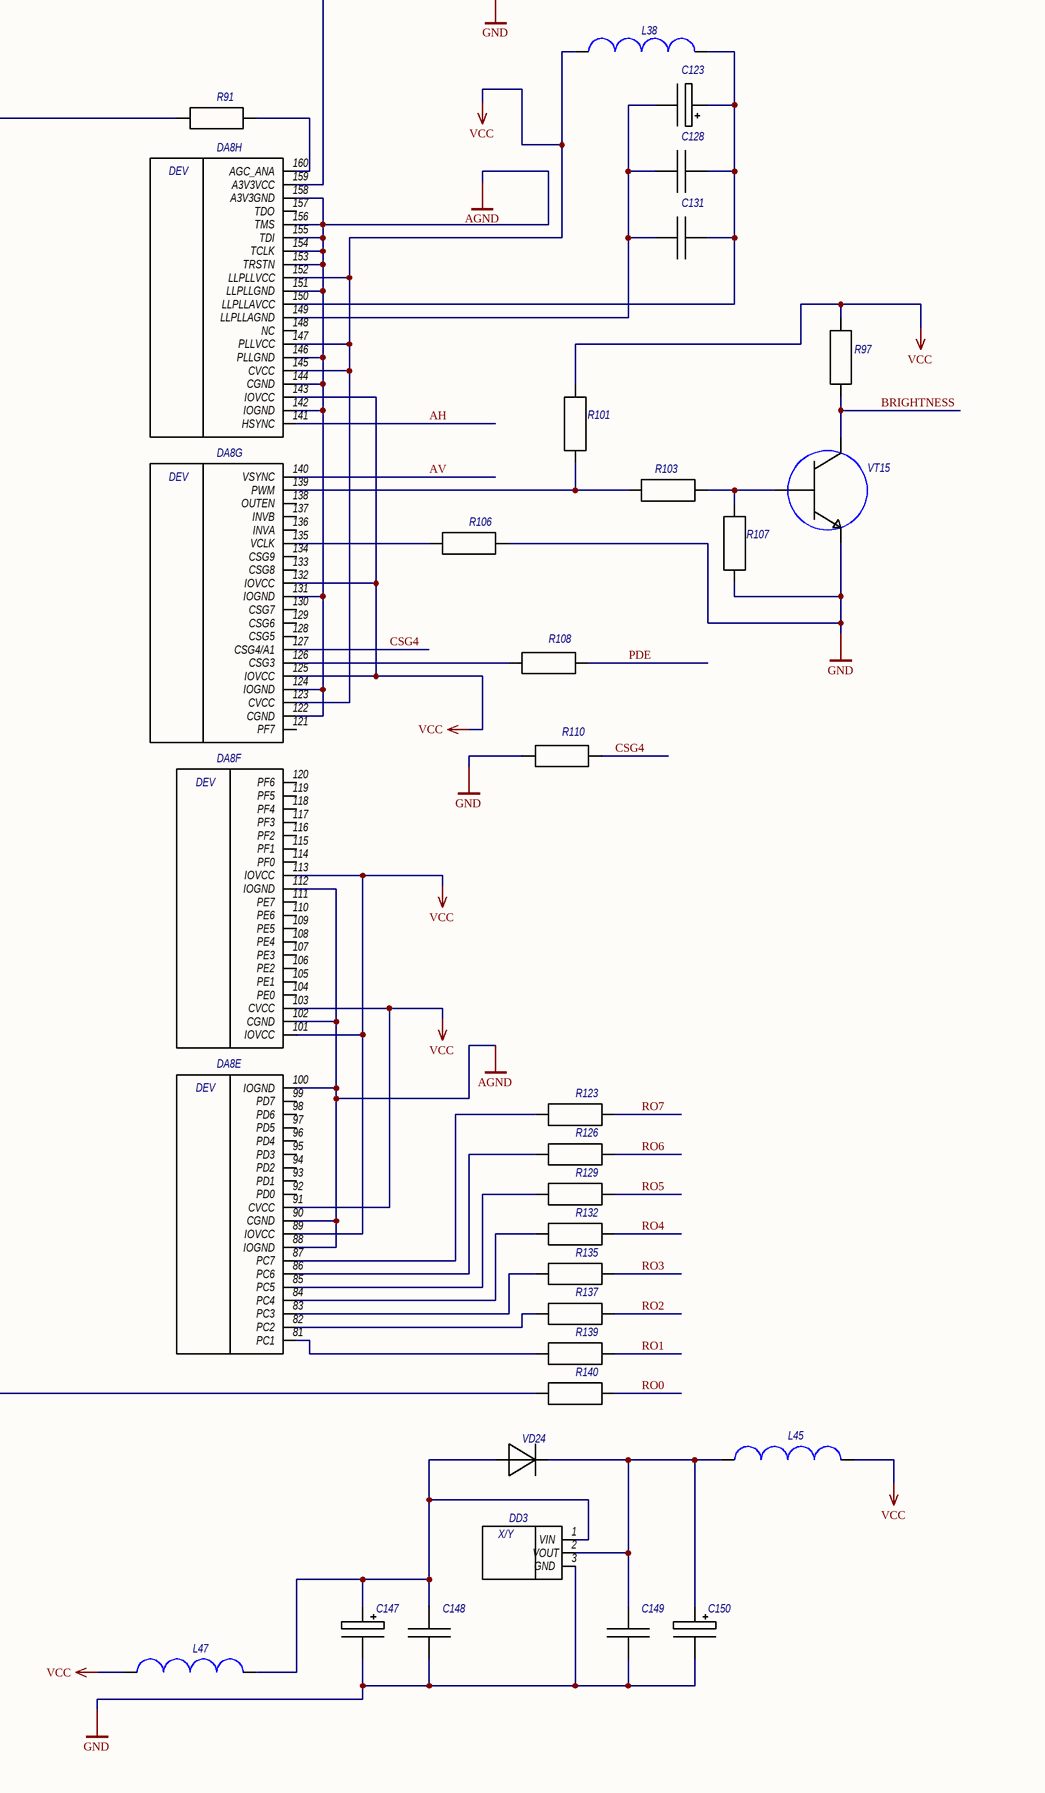
[diagram p7: sch5_1.SchDoc, bottom right]

### Parts
C97  *  [Capacitor 0805]  (value not drawn)
C98  *  [Capacitor 0805]  (value not drawn)
C99  *  [Capacitor 0805]  (value not drawn)
C100  *  [Capacitor 0805]  (value not drawn)
C101  *  [Capacitor 0805]  (value not drawn)
C102  *  [Capacitor 0805]  (value not drawn)
C103  *  [Capacitor 0805]  (value not drawn)
C104  *  [Capacitor 0805]  (value not drawn)
C105  *  [Capacitor 0805]  (value not drawn)
C106  *  [Capacitor 0805]  (value not drawn)
C107  *  [Capacitor 0805]  (value not drawn)
C108  *  [Capacitor 0805]  (value not drawn)
C109  *  [Capacitor 0805]  (value not drawn)
C110  *  [Capacitor 0805]  (value not drawn)
C111  *  [Capacitor 0805]  (value not drawn)
C112  *  [Capacitor 0805]  (value not drawn)
C113  *  [Capacitor 0805]  (value not drawn)
C114  *  [Capacitor 0805]  (value not drawn)
C115  *  [Capacitor 0805]  (value not drawn)
C116  *  [Capacitor 0805]  (value not drawn)
C117  *  [Capacitor 0805]  (value not drawn)
C118  *  [Capacitor 0805]  (value not drawn)
C119  *  [Capacitor 0805]  (value not drawn)
C120  *  [Capacitor 0805]  (value not drawn)
C121  *  [Capacitor 0805]  (value not drawn)
C122  *  [Capacitor 0805]  (value not drawn)
C123  *  [Capacitor 0805]  (value not drawn)
C124  *  [Capacitor 0805]  (value not drawn)
C125  *  [Capacitor 0805]  (value not drawn)
C126  *  [Capacitor 0805]  (value not drawn)
C127  *  [Capacitor 0805]  (value not drawn)
C128  *  [Capacitor 0805]  (value not drawn)
C129  *  [Capacitor 0805]  (value not drawn)
C130  *  [Capacitor 0805]  (value not drawn)
C131  *  [Capacitor 0805]  (value not drawn)
C132  *  [Capacitor 0805]  (value not drawn)
C133  *  [Capacitor 0805]  (value not drawn)
C134  *  [Capacitor 0805]  (value not drawn)
C135  *  [Capacitor 0805]  (value not drawn)
C136  *  [Capacitor 0805]  (value not drawn)
C137  *  [Capacitor 0805]  (value not drawn)
C138  *  [Capacitor 0805]  (value not drawn)
C139  *  [Capacitor 0805]  (value not drawn)
C140  *  [Capacitor 0805]  (value not drawn)
C141  *  [Capacitor 0805]  (value not drawn)
C142  *  [Capacitor 0805]  (value not drawn)
C143  *  [Capacitor 0805]  (value not drawn)
C144  *  [Capacitor 0805]  (value not drawn)
C145  *  [Capacitor 0805]  (value not drawn)
C146  *  [Capacitor 0805]  (value not drawn)
C147  *  [Capacitor 0805]  (value not drawn)
C148  *  [Capacitor 0805]  (value not drawn)
C149  *  [Capacitor 0805]  (value not drawn)
C150  *  [Capacitor 0805]  (value not drawn)
DA8  *  [OMG_1]  (value not drawn)  (parts A,B,C,D,E,F,G,H of 8)
DD3  *  [MIC39]  (value not drawn)
G1  *  [GENERATOR-25MHZ]  (value not drawn)
L34  *  [Inductor 2520]  (value not drawn)
L35  *  [Inductor 2520]  (value not drawn)
L36  *  [Inductor 2520]  (value not drawn)
L37  *  [Inductor 2520]  (value not drawn)
L38  *  [Inductor 2520]  (value not drawn)
L39  *  [Inductor 2520]  (value not drawn)
L40  *  [Inductor 2520]  (value not drawn)
L41  *  [Inductor 2520]  (value not drawn)
L42  *  [Inductor 2520]  (value not drawn)
L43  *  [Inductor 2520]  (value not drawn)
L44  *  [Inductor 2520]  (value not drawn)
L45  *  [Inductor 2520]  (value not drawn)
L46  *  [Inductor 2520]  (value not drawn)
L47  *  [Inductor 2520]  (value not drawn)
R88  *  [Resistor 1206]  (value not drawn)
R89  *  [Resistor 1206]  (value not drawn)
R90  *  [Resistor 1206]  (value not drawn)
R91  *  [Resistor 1206]  (value not drawn)
R92  *  [Resistor 1206]  (value not drawn)
R93  *  [Resistor 1206]  (value not drawn)
R94  *  [Resistor 1206]  (value not drawn)
R95  *  [Resistor 1206]  (value not drawn)
R96  *  [Resistor 1206]  (value not drawn)
R97  *  [Resistor 1206]  (value not drawn)
R98  *  [Resistor 1206]  (value not drawn)
R99  *  [Resistor 1206]  (value not drawn)
R100  *  [Resistor 1206]  (value not drawn)
R101  *  [Resistor 1206]  (value not drawn)
R102  *  [Resistor 1206]  (value not drawn)
R103  *  [Resistor 1206]  (value not drawn)
R104  *  [Resistor 1206]  (value not drawn)
R105  *  [Resistor 1206]  (value not drawn)
R106  *  [Resistor 1206]  (value not drawn)
R107  *  [Resistor 1206]  (value not drawn)
R108  *  [Resistor 1206]  (value not drawn)
R109  *  [Resistor 1206]  (value not drawn)
R110  *  [Resistor 1206]  (value not drawn)
R111  *  [Resistor 1206]  (value not drawn)
R112  *  [Resistor 1206]  (value not drawn)
R113  *  [Resistor 1206]  (value not drawn)
R114  *  [Resistor 1206]  (value not drawn)
R115  *  [Resistor 1206]  (value not drawn)
R116  *  [Resistor 1206]  (value not drawn)
R117  *  [Resistor 1206]  (value not drawn)
R118  *  [Resistor 1206]  (value not drawn)
R119  *  [Resistor 1206]  (value not drawn)
R120  *  [Resistor 1206]  (value not drawn)
R121  *  [Resistor 1206]  (value not drawn)
R122  *  [Resistor 1206]  (value not drawn)
R123  *  [Resistor 1206]  (value not drawn)
R124  *  [Resistor 1206]  (value not drawn)
R125  *  [Resistor 1206]  (value not drawn)
R126  *  [Resistor 1206]  (value not drawn)
R127  *  [Resistor 1206]  (value not drawn)
R128  *  [Resistor 1206]  (value not drawn)
R129  *  [Resistor 1206]  (value not drawn)
R130  *  [Resistor 1206]  (value not drawn)
R131  *  [Resistor 1206]  (value not drawn)
R132  *  [Resistor 1206]  (value not drawn)
R133  *  [Resistor 1206]  (value not drawn)
R134  *  [Resistor 1206]  (value not drawn)
R135  *  [Resistor 1206]  (value not drawn)
R136  *  [Resistor 1206]  (value not drawn)
R137  *  [Resistor 1206]  (value not drawn)
R138  *  [Resistor 1206]  (value not drawn)
R139  *  [Resistor 1206]  (value not drawn)
R140  *  [Resistor 1206]  (value not drawn)
VD23  *  [Diode]  (value not drawn)
VD24  *  [Diode]  (value not drawn)
VT13  MOP TRANSISTOR  [TR]  (value not drawn)
VT14  *  [Transistor 1]  (value not drawn)
VT15  *  [Transistor 1]  (value not drawn)

### Nets
AGND: C109.1 C110.1 C111.1 C140.1 C141.1 C142.1 C143.1 C144.1 C145.1 C146.1 DA8.1(CLEANGND_B) DA8.3(AVCC_ADC_B) DA8.10(CLEANGND_SOG) DA8.12(CLEANGND_G) DA8.14(AVCC_ADC_G) DA8.19(CLEANGND_R) DA8.21(AVCC_ADC_R) DA8.88(IOGND) DA8.90(CGND) DA8.100(IOGND) DA8.102(CGND) DA8.112(IOGND) DA8.122(CGND) DA8.124(IOGND) DA8.131(IOGND) DA8.142(IOGND) DA8.144(CGND) DA8.146(PLLGND) DA8.151(LLPLLGND) DA8.153(TRSTN) DA8.154(TCLK) DA8.155(TDI) DA8.156(TMS) DA8.158(A3V3GND) R91.1 VD23.1
GND: C97.1 C98.1 C99.1 C100.1 C101.1 C102.1 C103.1 C104.1 C105.1 C106.1 C107.1 C108.1 C112.1 C113.1 C114.1 C115.1 C116.1 C117.1 C118.1 C119.1 C120.1 C121.2 C124.1 C125.1 C126.1 C127.1 C136.2 C137.1 C138.1 C139.1 C147.1 C148.1 C149.1 C150.1 DA8.45(CGND) DA8.46(CVCC) DA8.48(IOGND) DA8.56(IOGND) DA8.66(IOGND) DA8.70(CGND) DA8.71(CVCC) DA8.78(IOGND) DD3.3(GND) G1.2(GND) L46.1 R105.1 R106.2 R107.1 R109.1 R110.1 R111.1 VT14.1(KOLLECTOR) VT15.1(KOLLECTOR)
VCC: C97.2 C98.2 C99.2 C100.2 C101.2 C102.2 C103.2 C104.2 C105.2 C106.2 C107.2 C108.2 C112.2 C113.2 C114.2 C115.2 C116.2 C117.2 C118.2 C119.2 C120.2 C124.2 C125.2 C126.2 C127.2 C136.1 C140.2 C141.2 C142.2 C143.2 C144.2 C145.2 C146.2 DA8.6(AVCC_B) DA8.17(AVCC_G) DA8.24(AVCC_R) DA8.29(TGND) DA8.35(TGND) DA8.39(TPLLGND) DA8.40(TPLLVCC) DA8.89(IOVCC) DA8.91(CVCC) DA8.101(IOVCC) DA8.103(CVCC) DA8.113(IOVCC) DA8.123(CVCC) DA8.125(IOVCC) DA8.132(IOVCC) DA8.143(IOVCC) DA8.145(CVCC) DA8.147(PLLVCC) DA8.152(LLPLLVCC) L34.1 L34.2 L35.1 L36.1 L36.2 L37.1 L37.2 L38.1 L39.1 L39.2 L40.2 L41.2 L42.1 L43.1 L43.2 L44.1 L44.2 L45.2 L47.1 R94.2 R97.2 R101.2
ADCPWR_CTL: R100.1
AH: DA8.141(HSYNC)
AV: DA8.140(VSYNC)
B_IN: R89.1
BO0: R117.1
BO1: R118.1
BO2: R120.1
BO3: R122.1
BO4: R125.1
BO5: R128.1
BO6: R131.1
BO7: R134.1
BRIGHTNESS: R97.1 VT15.2(EMITTER)
CSG2: DA8.55(CSG2/A0) L46.2
CSG4: DA8.127(CSG4/A1) R110.2
G_IN: C130.2 R95.1
GO0: R119.1
GO1: R121.1
GO2: R124.1
GO3: R127.1
GO4: R130.1
GO5: R133.1
GO6: R136.1
GO7: R138.1
PCLK: R114.1
PDE: R108.2
PHD: R115.1
PVD: R116.1
R_IN: R90.1 R92.1 R93.1 R96.1 R98.1 R99.1 R102.1 R104.1
RO0: R140.2
RO1: R139.2
RO2: R137.2
RO3: R135.2
RO4: R132.2
RO5: R129.2
RO6: R126.2
RO7: R123.2
RX0+: DA8.33(RX0P)
RX0-: DA8.34(RX0N)
RX1+: DA8.30(RX1P)
RX1-: DA8.31(RX1N)
RX2+: DA8.5(AGND_ADC_B) DA8.7(AGND_B) DA8.16(AGND_ADC_G) DA8.18(AGND_G) DA8.23(AGND_ADC_R) DA8.25(AGND_R) DA8.27(RX2P)
RX2-: DA8.28(RX2N)
RXC+: DA8.37(RXCP)
RXC-: DA8.36(RXCN)
SCALER_INTN: R113.1
SCALER_RSTN: DA8.51(RSTn)
SCL: DA8.42(SCL)
SDA: DA8.41(SDA)
NetC109_2: C109.2 C110.2 C111.2 DA8.159(A3V3VCC) L35.2 R88.2
NetC121_1: C121.1 DA8.8(AT3VCC)
NetC122_1: C122.1 DA8.2(BIN)
NetC122_2: C122.2 R89.2 R90.2
NetC123_1: C123.1 C128.2 C131.2 DA8.149(LLPLLAGND)
NetC123_2: C123.2 C128.1 C131.1 DA8.150(LLPLLAVCC) L38.2
NetC129_1: C129.1 DA8.4(REF_B)
NetC129_2: C129.2 R92.2
NetC130_1: C130.1 DA8.11(SOGIN)
NetC132_1: C132.1 DA8.13(GIN)
NetC132_2: C132.2 R95.2 R96.2
NetC133_1: C133.1 DA8.15(REF_G)
NetC133_2: C133.2 R98.2
NetC134_1: C134.1 DA8.20(RIN)
NetC134_2: C134.2 R99.2 R102.2
NetC135_1: C135.1 DA8.22(REF_R)
NetC135_2: C135.2 R104.2
NetC137_2: C137.2 C138.2 G1.4(VCC) L42.2
NetC139_2: C139.2 DA8.47(CLK) R112.2
NetC147_2: C147.2 C148.2 DD3.1(VIN) L47.2 VD24.1
NetC149_2: C149.2 C150.2 DD3.2(VOUT) L45.1 VD24.2
NetDA8_9: DA8.9(RBIAS_EXT) R93.2
NetDA8_26: DA8.26(TVCC) DA8.38(TVCC)
NetDA8_43: DA8.43(HSDA) R109.2
NetDA8_44: DA8.44(HSCL) R111.2
NetDA8_49: DA8.49(IOVCC) DA8.57(IOVCC) DA8.67(IOVCC) DA8.79(IOVCC)
NetDA8_50: DA8.50(INTn) R113.2
NetDA8_52: DA8.52(PCLK) R114.2
NetDA8_53: DA8.53(CSG0) R115.2
NetDA8_54: DA8.54(CSG1) R116.2
NetDA8_58: DA8.58(PA0) R117.2
NetDA8_59: DA8.59(PA1) R118.2
NetDA8_60: DA8.60(PA2) R120.2
NetDA8_61: DA8.61(PA3) R122.2
NetDA8_62: DA8.62(PA4) R125.2
NetDA8_63: DA8.63(PA5) R128.2
NetDA8_64: DA8.64(PA6) R131.2
NetDA8_65: DA8.65(PA7) R134.2
NetDA8_68: DA8.68(PB0) R119.2
NetDA8_69: DA8.69(PB1) R121.2
NetDA8_72: DA8.72(PB2) R124.2
NetDA8_73: DA8.73(PB3) R127.2
NetDA8_74: DA8.74(PB4) R130.2
NetDA8_75: DA8.75(PB5) R133.2
NetDA8_76: DA8.76(PB6) R136.2
NetDA8_77: DA8.77(PB7) R138.2
NetDA8_80: DA8.80(PC0) R140.1
NetDA8_81: DA8.81(PC1) R139.1
NetDA8_82: DA8.82(PC2) R137.1
NetDA8_83: DA8.83(PC3) R135.1
NetDA8_84: DA8.84(PC4) R132.1
NetDA8_85: DA8.85(PC5) R129.1
NetDA8_86: DA8.86(PC6) R126.1
NetDA8_87: DA8.87(PC7) R123.1
NetDA8_126: DA8.126(CSG3) R108.1
NetDA8_135: DA8.135(VCLK) R106.1
NetDA8_139: DA8.139(PWM) R101.1 R103.1
NetDA8_160: DA8.160(AGC_ANA) R91.2
NetG1_3: G1.3(OUT) R112.1
NetL40_1: L40.1 VT13.3 VT13.4
NetL41_1: L41.1 VT13.2
NetR88_1: R88.1 VD23.2
NetR94_1: R94.1 VT13.1 VT14.2(EMITTER)
NetR100_2: R100.2 R105.2 VT14.3(BAZA)
NetR103_2: R103.2 R107.2 VT15.3(BAZA)

Not connected (* = marked no-connect by the designer): DA8 32(TVCC)* 92(PD0) 93(PD1) 94(PD2) 95(PD3) 96(PD4) 97(PD5) 98(PD6) 99(PD7) 104(PE0) 105(PE1) 106(PE2) 107(PE3) 108(PE4) 109(PE5) 110(PE6) 111(PE7) 114(PF0) 115(PF1) 116(PF2) 117(PF3) 118(PF4) 119(PF5) 120(PF6) 121(PF7) 128(CSG5) 129(CSG6) 130(CSG7) 133(CSG8) 134(CSG9) 136(INVA) 137(INVB) 138(OUTEN) 148(NC) 157(TDO); G1 1(NC)*

### Notes on the sheet
- Перв. примен.
- Справ. №
- Подп. и дата
- Инв. № дубл.
- Взам. инв. №
- Разраб.
- Изм.
- Лист
- № докум.
- Подп.
- Дата
- Лит.
- Масса
- Масштаб
- Пров.
- Т.контр.
- Листов
- Инв. № подл.
- Утв.
- Н.контр.
- 2.106-A1
- Копировал
- Формат А1
- (in symbol MHZ25) Gn
- (in symbol MIC39) X/Y
- (in symbol OMG, part A) DEV
- (in symbol OMG, part B) DEV
- (in symbol OMG, part C) DEV
- (in symbol OMG, part D) DEV
- (in symbol OMG, part E) DEV
- (in symbol OMG, part F) DEV
- (in symbol OMG, part G) DEV
- (in symbol OMG, part H) DEV

### Library data of the parts
C97 C109 C112 C123 C146 C147 C150 = Capacitor Duga: Model: *
C98-C108 C110 C111 C113-C122 C124-C145 C148 C149 = Capacitor: Model: *
DA8 = OMG
DD3 = MIC39
G1 = MHZ25
L34-L47 = Inductor: Model: *
R88-R140 = Resistor: Model: *
VD23 VD24 = Diode 1: Model: *
VT14 VT15 = Transistor 1

## Sheet sch6.SchDoc
size 420 x 297 mm; Address1: Address1; Address2: Address2; Address3: Address3; Address4: Address4; DocumentNumber: АБВГ.123456.001 Э3; SheetNumber: 1; Scale: 1:1; DocumentType: Схема электрическая принципиальная; FirstReferrence: АБВГ.123456.001
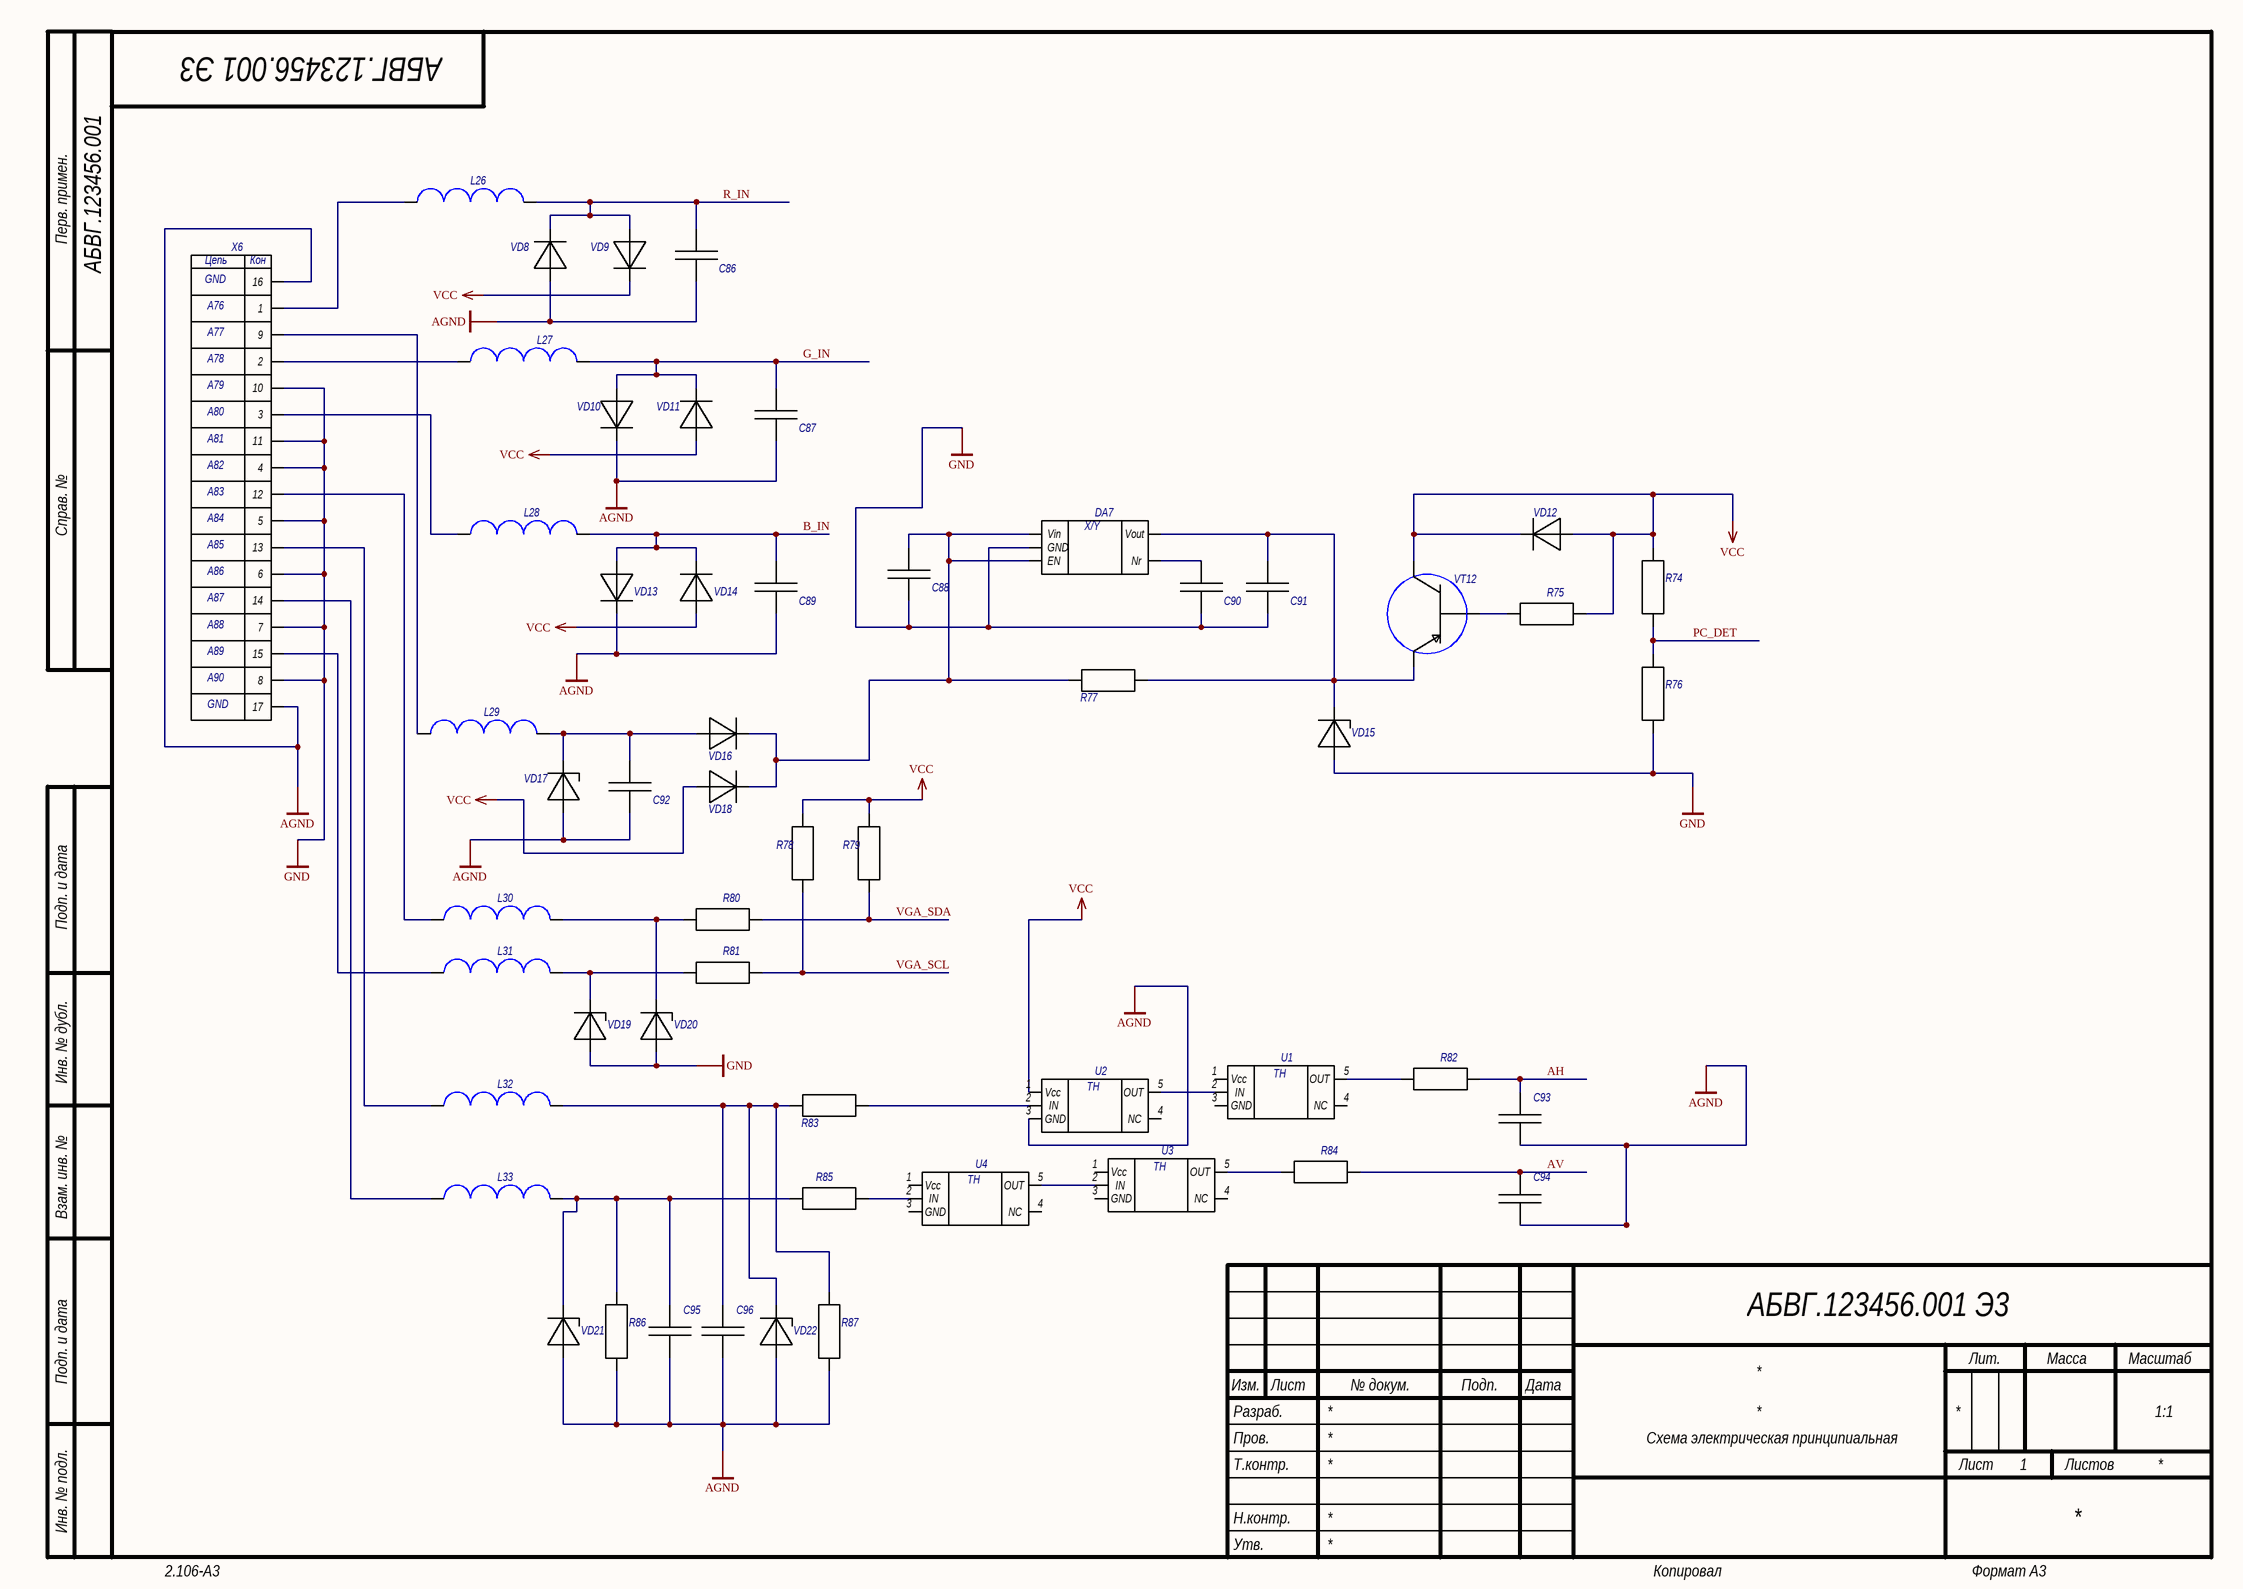
[diagram p8: sch6.SchDoc]

### Parts
C86  *  [Capacitor 0805]  (value not drawn)
C87  *  [Capacitor 0805]  (value not drawn)
C88  *  [Capacitor 0805]  (value not drawn)
C89  *  [Capacitor 0805]  (value not drawn)
C90  *  [Capacitor 0805]  (value not drawn)
C91  *  [Capacitor 0805]  (value not drawn)
C92  *  [Capacitor 0805]  (value not drawn)
C93  *  [Capacitor 0805]  (value not drawn)
C94  *  [Capacitor 0805]  (value not drawn)
C95  *  [Capacitor 0805]  (value not drawn)
C96  *  [Capacitor 0805]  (value not drawn)
DA7  *  [MIC5205]  (value not drawn)
L26  *  [Inductor 2520]  (value not drawn)
L27  *  [Inductor 2520]  (value not drawn)
L28  *  [Inductor 2520]  (value not drawn)
L29  *  [Inductor 2520]  (value not drawn)
L30  *  [Inductor 2520]  (value not drawn)
L31  *  [Inductor 2520]  (value not drawn)
L32  *  [Inductor 2520]  (value not drawn)
L33  *  [Inductor 2520]  (value not drawn)
R74  *  [Resistor 1206]  (value not drawn)
R75  *  [Resistor 1206]  (value not drawn)
R76  *  [Resistor 1206]  (value not drawn)
R77  *  [Resistor 1206]  (value not drawn)
R78  *  [Resistor 1206]  (value not drawn)
R79  *  [Resistor 1206]  (value not drawn)
R80  *  [Resistor 1206]  (value not drawn)
R81  *  [Resistor 1206]  (value not drawn)
R82  *  [Resistor 1206]  (value not drawn)
R83  *  [Resistor 1206]  (value not drawn)
R84  *  [Resistor 1206]  (value not drawn)
R85  *  [Resistor 1206]  (value not drawn)
R86  *  [Resistor 1206]  (value not drawn)
R87  *  [Resistor 1206]  (value not drawn)
U1  *  [MIC5205]  (value not drawn)
U2  *  [MIC5205]  (value not drawn)
U3  *  [MIC5205]  (value not drawn)
U4  *  [MIC5205]  (value not drawn)
VD8  *  [Diode]  (value not drawn)
VD9  *  [Diode]  (value not drawn)
VD10  *  [Diode]  (value not drawn)
VD11  *  [Diode]  (value not drawn)
VD12  *  [Diode]  (value not drawn)
VD13  *  [Diode]  (value not drawn)
VD14  *  [Diode]  (value not drawn)
VD15  *  [Diode]  (value not drawn)
VD16  *  [Diode]  (value not drawn)
VD17  *  [Diode]  (value not drawn)
VD18  *  [Diode]  (value not drawn)
VD19  *  [Diode]  (value not drawn)
VD20  *  [Diode]  (value not drawn)
VD21  *  [Diode]  (value not drawn)
VD22  *  [Diode]  (value not drawn)
VT12  *  [Transistor 1]  (value not drawn)
X6  *  [VGA Connector]  (value not drawn)

### Nets
AGND: C86.1 C87.1 C89.1 C92.1 C93.1 C94.1 C95.1 C96.1 R86.1 R87.1 U2.3(GND) VD8.1 VD10.2 VD13.2 VD17.1 VD21.1 VD22.1 X6.16 X6.17
GND: C88.1 C90.1 C91.1 DA7.2(GND) R76.1 VD15.1 VD19.1 VD20.1 X6.4 X6.5 X6.6 X6.7 X6.8 X6.10 X6.11
VCC: R74.2 R75.2 R78.2 R79.2 U2.1(Vcc) VD9.2 VD11.1 VD12.1 VD12.2 VD14.1 VD18.1 VT12.1(KOLLECTOR)
AH: C93.2 R82.2
AV: C94.2 R84.2
B_IN: C89.2 L28.2 VD13.1 VD14.2
G_IN: C87.2 L27.2 VD10.1 VD11.2
PC_DET: R74.1 R76.2
R_IN: C86.2 L26.2 VD8.2 VD9.1
VGA_SCL: R78.1 R81.2
VGA_SDA: R79.1 R80.2
NetC88_2: C88.2 DA7.1(Vin) DA7.3(EN) R77.1 VD16.2 VD18.2
NetC90_2: C90.2 DA7.4(Nr)
NetC91_2: C91.2 DA7.5(Vout) R77.2 VD15.2 VT12.2(EMITTER)
NetC92_2: C92.2 L29.2 VD16.1 VD17.2
NetC95_2: C95.2 L33.2 R85.1 R86.2 VD21.2
NetC96_2: C96.2 L32.2 R83.1 R87.2 VD22.2
NetL26_1: L26.1 X6.1
NetL27_1: L27.1 X6.2
NetL28_1: L28.1 X6.3
NetL29_1: L29.1 X6.9
NetL30_1: L30.1 X6.12
NetL30_2: L30.2 R80.1 VD20.2
NetL31_1: L31.1 X6.15
NetL31_2: L31.2 R81.1 VD19.2
NetL32_1: L32.1 X6.13
NetL33_1: L33.1 X6.14
NetR75_1: R75.1 VT12.3(BAZA)
NetR82_1: R82.1 U1.5(OUT)
NetR83_2: R83.2 U2.2(IN)
NetR84_1: R84.1 U3.5(OUT)
NetR85_2: R85.2 U4.2(IN)
NetU1_2: U1.2(IN) U2.5(OUT)
NetU3_2: U3.2(IN) U4.5(OUT)

Not connected (* = marked no-connect by the designer): U1 1(Vcc) 3(GND) 4(NC); U2 4(NC); U3 1(Vcc) 3(GND) 4(NC); U4 1(Vcc) 3(GND) 4(NC)

### Notes on the sheet
- Перв. примен.
- Справ. №
- Подп. и дата
- Инв. № дубл.
- Взам. инв. №
- Разраб.
- Изм.
- Лист
- № докум.
- Подп.
- Дата
- Лит.
- Масса
- Масштаб
- Пров.
- Т.контр.
- Листов
- Инв. № подл.
- Утв.
- Н.контр.
- 2.106-A3
- Копировал
- Формат А3
- (in symbol MIC52) X/Y
- (in symbol Schmitt Inv) TH
- (in symbol VGA connector) Цепь; Кон; GND; A76; A77; A78; A79; A80; A81; A82; A83; A84; A85; A86; A87; A88; A89; A90

### Library data of the parts
C86-C96 = Capacitor: Model: *
DA7 = MIC52
L26-L33 = Inductor: Model: *
R74-R87 = Resistor: Model: *
U1-U4 = Schmitt Inv
VD8-VD14 VD16 VD18 = Diode 1: Model: *
VD15 VD17 VD19-VD22 = Diode 2: Model: *
VT12 = Transistor 2
X6 = VGA connector

## Nets that join several sheets
AGND: sch5_1 (36 pins), sch6 (19 pins)
GND: sch1 (13 pins), sch2 (59 pins), sch3 (27 pins), sch4 (48 pins), sch5_1 (53 pins), sch6 (15 pins)
VCC: sch1 (5 pins), sch2 (L3.2 L4.2 L5.2 L6.1), sch3 (19 pins), sch4 (23 pins), sch5_1 (74 pins), sch6 (12 pins)
ADCPWR_CTL: sch3 (DA2.36 R26.1), sch5_1 (R100.1)
AH: sch5_1 (DA8.141), sch6 (C93.2 R82.2)
AV: sch5_1 (DA8.140), sch6 (C94.2 R84.2)
B_IN: sch5_1 (R89.1), sch6 (C89.2 L28.2 VD13.1 VD14.2)
BACKLIG_ON_OFF: sch3 (R28.2 VT4.2), sch4 (R71.2)
BO0: sch2 (C32.2 DD1.16), sch5_1 (R117.1)
BO1: sch2 (C31.2 DD1.19), sch5_1 (R118.1)
BO2: sch2 (C30.2 DD1.20), sch5_1 (R120.1)
BO3: sch2 (C29.2 DD1.21), sch5_1 (R122.1)
BO4: sch2 (C28.2 DD1.22 DD1.23), sch5_1 (R125.1)
BO5: sch2 (C27.2), sch5_1 (R128.1)
BO6: sch2 (C26.2 DD1.17), sch5_1 (R131.1)
BO7: sch2 (C25.2 DD1.18), sch5_1 (R134.1)
BRIGHTNESS: sch4 (R73.2), sch5_1 (R97.1 VT15.2)
DVI_DETN: sch1 (L2.2 VT1.2), sch3 (DA2.31)
G_IN: sch5_1 (C130.2 R95.1), sch6 (C87.2 L27.2 VD10.1 VD11.2)
GO0: sch2 (C17.1 DD1.8), sch5_1 (R119.1)
GO1: sch2 (C18.1 DD1.9), sch5_1 (R121.1)
GO2: sch2 (C19.1 DD1.10), sch5_1 (R124.1)
GO3: sch2 (C20.1 DD1.13), sch5_1 (R127.1)
GO4: sch2 (C36.2 DD1.14), sch5_1 (R130.1)
GO5: sch2 (C35.2 DD1.15), sch5_1 (R133.1)
GO6: sch2 (C34.2 DD1.11), sch5_1 (R136.1)
GO7: sch2 (C33.2 DD1.12), sch5_1 (R138.1)
LVDSPWR: sch2 (DD1.47), sch3 (DA2.33)
PANELVCC_CTL: sch2 (C39.2 R18.1), sch3 (DA2.35 R27.1)
PC_DET: sch3 (DA2.30), sch6 (R74.1 R76.2)
PCLK: sch2 (C40.2 R20.1), sch5_1 (R114.1)
PDE: sch2 (C41.2 DD1.27), sch5_1 (R108.2)
PHD: sch2 (C43.2 DD1.25), sch5_1 (R115.1)
PVD: sch2 (C42.2 DD1.26), sch5_1 (R116.1)
PWR_SW: sch3 (L12.2 R48.1), sch4 (R67.1 R68.1)
R_IN: sch5_1 (8 pins), sch6 (C86.2 L26.2 VD8.2 VD9.1)
RO0: sch2 (C9.1 DD1.1), sch3 (X3.1), sch5_1 (R140.2)
RO1: sch2 (C10.1 DD1.2), sch5_1 (R139.2)
RO2: sch2 (C11.1 DD1.3), sch5_1 (R137.2)
RO3: sch2 (C12.1 DD1.4), sch3 (X3.4), sch5_1 (R135.2)
RO4: sch2 (C13.1 DD1.5), sch5_1 (R132.2)
RO5: sch2 (C14.1 DD1.7), sch5_1 (R129.2)
RO6: sch2 (C15.1 DD1.28), sch5_1 (R126.2)
RO7: sch2 (C16.1 DD1.6), sch5_1 (R123.2)
RX0+: sch1 (R14.2 X1.18), sch5_1 (DA8.33)
RX0-: sch1 (R13.2 X1.17), sch5_1 (DA8.34)
RX1+: sch1 (R3.1 X1.10), sch5_1 (DA8.30)
RX1-: sch1 (R4.1 X1.9), sch5_1 (DA8.31)
RX2+: sch1 (R1.1 X1.2), sch5_1 (7 pins)
RX2-: sch1 (R2.1 X1.1), sch5_1 (DA8.28)
RXC+: sch1 (R12.2 X1.24), sch5_1 (DA8.37)
RXC-: sch1 (R11.2 X1.23), sch5_1 (DA8.36)
SCALER_INTN: sch3 (11 pins), sch5_1 (R113.1)
SCALER_RSTN: sch3 (C50.2 DA2.14 R33.2), sch5_1 (DA8.51)
SCL: sch3 (DA3.7 R23.2), sch5_1 (DA8.42)
SDA: sch3 (DA3.8 R22.2), sch5_1 (DA8.41)
TP_CTL: sch3 (DA2.32), sch4 (DA5.2)
VGA_SCL: sch3 (DA2.26), sch6 (R78.1 R81.2)
VGA_SDA: sch3 (DA2.25), sch6 (R79.1 R80.2)